# Altium project TMPTBRD_V3.PrjPcb (part 1 of 2)
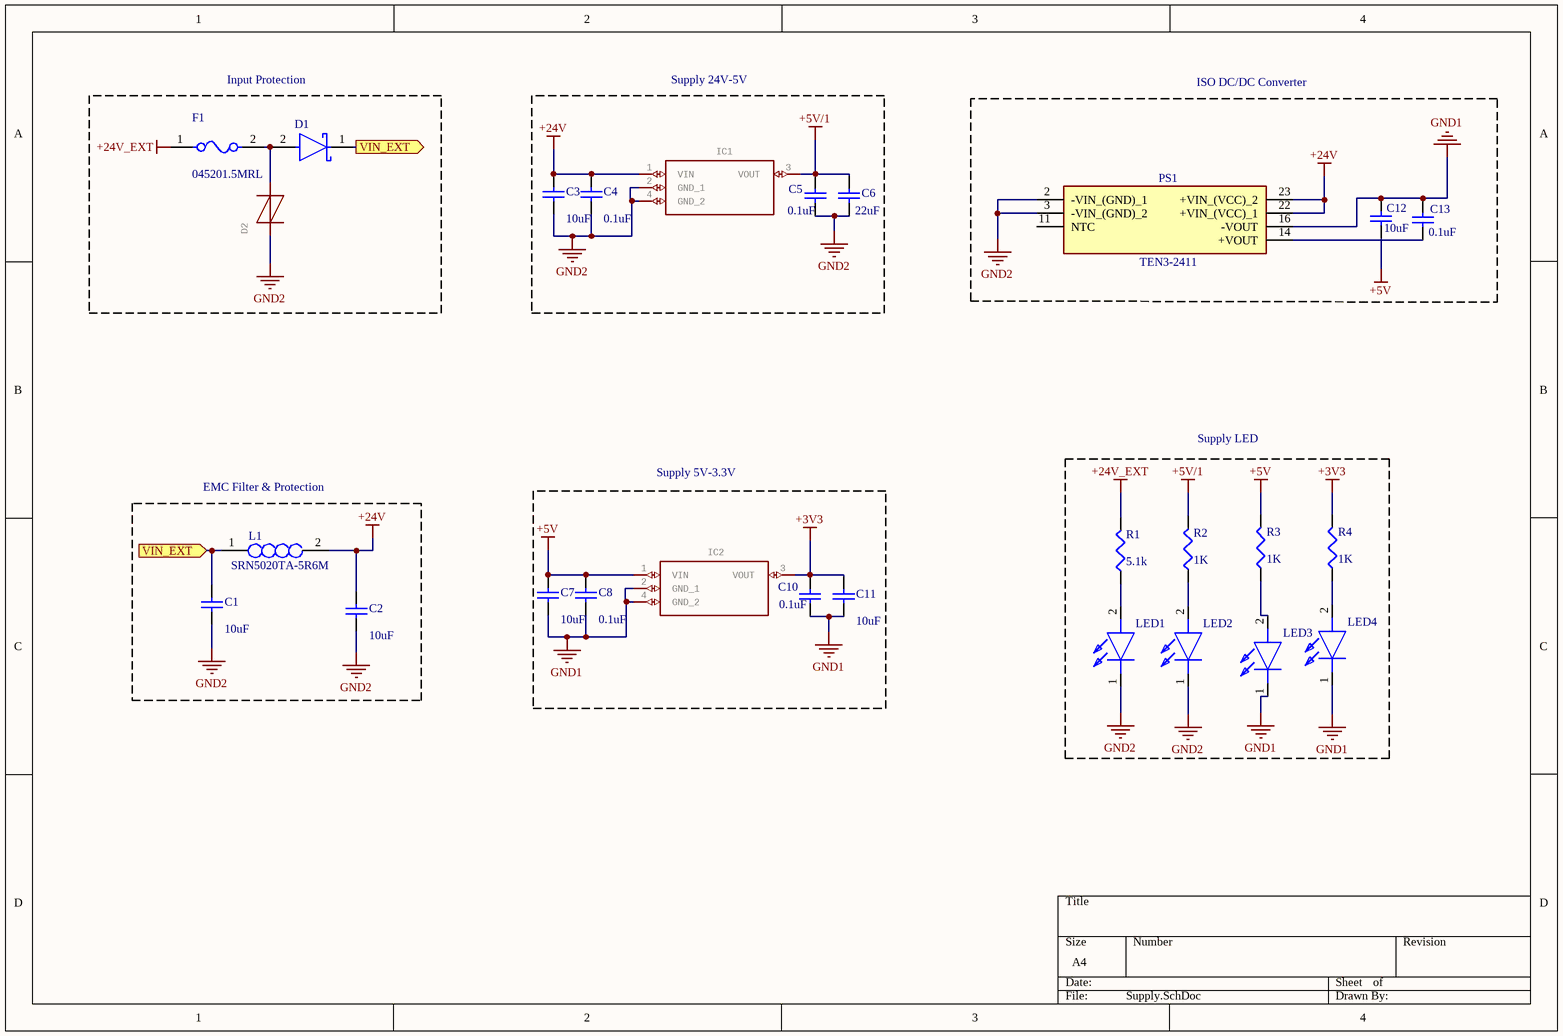
[diagram p0: Supply.SchDoc]
10 sheets, 192 parts. Net scope: flat (ports and power ports of the same name join across sheets).
Sheets:
  Supply.SchDoc
  MCU.SchDoc
  MCU_compnts.SchDoc
  Led RGB.SchDoc
  ISO_CAN2.SchDoc
  EEPROM&RTC.SchDoc
  uSD.SchDoc
  USART.SchDoc
  Relays_channels.SchDoc
  TMPT_LTC_1.SchDoc

## Sheet Supply.SchDoc
size A4; SheetNumber: 1; SheetTotal: 10

### Parts
C1  value 10uF  [1608[0603]]  (hidden comment: Cap Semi)
C2  value 10uF  [1608[0603]]  (hidden comment: Cap Semi)
C3  value 10uF  [1608[0603]]  (hidden comment: Cap Semi)
C4  value 0.1uF  [1608[0603]]  (hidden comment: Cap Semi)
C5  value 0.1uF  [1608[0603]]  (hidden comment: Cap Semi)
C6  value 22uF  [1608[0603]]  (hidden comment: Cap Semi)
C7  value 10uF  [1608[0603]]  (hidden comment: Cap Semi)
C8  value 0.1uF  [1608[0603]]  (hidden comment: Cap Semi)
C10  value 0.1uF  [1608[0603]]  (hidden comment: Cap Semi)
C11  value 10uF  [1608[0603]]  (hidden comment: Cap Semi)
C12  value 10uF  [C1206]  (hidden comment: Cap Semi)
C13  value 0.1uF  [C1206]  (hidden comment: Cap Semi)
D1  NRVTSS5100ET3G  [FP-403A-03-MFG]  (value not drawn)
D2  Thyristor Surge Protection Devices (TSPD) 500A 25V  [LIBRARY_DIODES_FUSE_SMB]  (value not drawn)
F1  045201.5MRL  [FP-0452-MFG]
IC1  LDO LDO Voltage Regulators 5.0V/400MA LDO + Tab-Pin SOT-223  [SOT223]  (value not drawn)
IC2  LDO Regulator 3.3V 1% 300mA SOT223 ON Semiconductor MC33275ST-3.3T3G, LDO Voltage Regulator, 300mA, 3.3 V, Maximum of 13 Vin, 3 + Tab-Pin SOT-223   Source:  Datasheet  [SOT223]  (value not drawn)
L1  SRN5020TA-5R6M  [INDPM5050X200N]
LED1  SML-D12D1WT86  [LEDC1608X55N]  (value not drawn)
LED2  SML-D12D1WT86  [LEDC1608X55N]  (value not drawn)
LED3  SML-D12D1WT86  [LEDC1608X55N]  (value not drawn)
LED4  SML-D12D1WT86  [LEDC1608X55N]  (value not drawn)
PS1  TEN3-2411  [TEN30515N]
R1  value 5.1k  [J1-0603]  (hidden comment: Res3)
R2  value 1K  [J1-0603]  (hidden comment: Res3)
R3  value 1K  [J1-0603]  (hidden comment: Res3)
R4  value 1K  [J1-0603]  (hidden comment: Res3)

### Blocks framed on the sheet
Input Protection: D1 D2 F1
Supply 24V-5V: C3-C6 IC1
ISO DC/DC Converter: C12 C13 PS1
Supply LED: LED1-LED4 R1-R4
EMC Filter & Protection: C1 C2 L1
Supply 5V-3.3V: C7 C8 C10 C11 IC2

### Ports
VIN_EXT (in), VIN_EXT (out)

### Nets
+3V3: C10.2 C11.2 IC2.3(VOUT) R4.2
+5V: C7.2 C8.2 C12.1 IC2.1(VIN) R3.2
+5V/1: C5.2 C6.2 IC1.3(VOUT) R2.2
+24V: C2.2 C3.2 C4.2 IC1.1(VIN) L1.2 PS1.22(+VIN_(VCC)_1) PS1.23(+VIN_(VCC)_2)
+24V_EXT: F1.1 R1.2
GND1: C7.1 C8.1 C10.1 C11.1 C12.2 C13.2 IC2.2(GND_1) IC2.4(GND_2) LED3.1(K) LED4.1(K) PS1.16(-VOUT)
GND2: C1.1 C2.1 C3.1 C4.1 C5.1 C6.1 D2.2(T) IC1.2(GND_1) IC1.4(GND_2) LED1.1(K) LED2.1(K) PS1.2(-VIN_(GND)_1) PS1.3(-VIN_(GND)_2)
NetC1_2: C1.2 D1.1(C) L1.1 ; port VIN_EXT
NetC13_1: C13.1 PS1.14(+VOUT)
NetD1_2: D1.2(A) D2.1(R) F1.2
NetLED1_2: LED1.2(A) R1.1
NetLED2_2: LED2.2(A) R2.1
NetLED3_2: LED3.2(A) R3.1
NetLED4_2: LED4.2(A) R4.1

Not connected (* = marked no-connect by the designer): PS1 11(NTC)

### Library data of the parts
C1-C8 C10-C13 = Cap Semi: Capacitor (Semiconductor SIM Model); Published: 8-Jun-2000; LatestRevisionDate: 29-May-2009; LatestRevisionNote: IPC-7351 Footprint Added.; PackageReference: C1206; Publisher: Altium Limited; PackageDescription: Chip Capacitor
D1 = CMP-07162-000014-1: Trench Schottky Rectifier, Very Low Leakage, 100V, 5A,; Manufacturer: ON Semiconductor; Max Junction Temp: +175°C; Standoff Height: 0.05mm; Peak Reverse Current: 2.6uA; Automotive Grade: Grade 0; Max Surge Forward Current: 50A; Capacitance: 54.5pF; Value: 54.5pF; Category: Diode; Forward Current: 5A; ComponentLink2Description: Datasheet; Reverse Voltage: 100V; Manufacturer Part Number: NRVTSS5100ET3G; Automotive: Yes; ComponentLink2URL: https://www.onsemi.com/pub/Collateral/NRVTSS5100E-D.PDF; Device Class L1: Discrete Semiconductors; Height: 2.47mm; Temperature Range Low: -55°C; Footprint Url: https://www.onsemi.com/pub/Collateral/403A-03.PDF; Lead Free: Yes; Temperature Range High: +175°C; RoHS: TRUE; Temperature: -55°C to +175°C; Device Class L3: Schottky Diodes; Package: 403A-03; Octopart: https://octopart.com/nrvtss5100et3g-on+semiconductor-54318003; Max Repetitive Reverse Voltage: 100V; Device Class L2: Diodes; Mouser Description: Trench Schottky Rectifier, Very Low Leakage, 100V, 5A,
D2 = P0300SCLRP: GateName_1: G$1; SymbolName_1: LIBRARY_DIODES_FUSE_TISP4040H1BJR-S; LibraryName: COMPAQ; DeviceSetName: P0300SCLRP; Package: LIBRARY_DIODES_FUSE_SMB
F1 = CMP-08605-000038-1: FUSE BRD MNT 1.5A 125VAC/VDC SMD; Manufacturer: Littelfuse Inc; Value: 0.093Ω; Fuse Interrupt Ac Current: 50A; Max Fuse Dc Voltage: 125V; Fuse Blow Speed: Slow; Fuse I2T: 3.65A2Sec; Fuse Interrupt Dc Current: 300A; Device Class L2: Fuses; Device Class L3: unset; Temperature Range High: +125°C; Manufacturer Part Number: 045201.5MRL; Temperature: -55°C to +125°C; Fuse Current: 1.5A; ComponentLink2Description: Datasheet; Temperature Range Low: -55°C; Resistance: 0.093Ω; Package: 0452; RoHS: TRUE; Max Fuse Ac Voltage: 125V; Category: Fuse; Mouser Description: Surface Mount Fuses 125V 1.5A; Device Class L1: Circuit Protection; Octopart: https://octopart.com/045201.5mrl-littelfuse-566412; ComponentLink2URL: https://www.littelfuse.com/~/media/electronics/datasheets/fuses/littelfuse_fuse_452_454_datasheet.pdf.pdf; Lead Free: Yes; Automotive: No; Height: 2.94mm; Digikey Description: FUSE BRD MNT 1.5A 125VAC/VDC SMD; Voltage Rating: 125V
IC1 = NCV4274CST50T3G: GateName_1: G$1; SymbolName_1: MC33275ST-3.3T3G; LibraryName: COMPAQ; DeviceSetName: NCV4274CST50T3G; Package: SOT223
IC2 = MC33275ST-3.3T3G: GateName_1: G$1; SymbolName_1: MC33275ST-3.3T3G; LibraryName: COMPAQ; DeviceSetName: MC33275ST-3.3T3G; Package: SOT223
L1 = SRN5020TA-5R6M: Inductor; Manufacturer_Name: Bourns; Datasheet Link: https://www.arrow.com/en/products/srn5020ta-5r6m/bourns; Height: 2mm; Manufacturer_Part_Number: SRN5020TA-5R6M; Mouser Part Number: 652-SRN5020TA-5R6M; Mouser Price/Stock: https://www.mouser.com/Search/Refine.aspx?Keyword=652-SRN5020TA-5R6M; Arrow Part Number: SRN5020TA-5R6M; Arrow Price/Stock: https://www.arrow.com/en/products/srn5020ta-5r6m/bourns
LED1-LED4 = SML-D12D1WT86: LED; Manufacturer_Name: ROHM Semiconductor; Datasheet Link: https://www.rohm.com/datasheet/SML-D12D1W/sml-d12x1-e; Height: 0.55mm; Manufacturer_Part_Number: SML-D12D1WT86; Mouser Part Number: 755-SML-D12D1WT86; Mouser Price/Stock: https://www.mouser.co.uk/ProductDetail/ROHM-Semiconductor/SML-D12D1WT86/?qs=M3jcYzEJUdEqFdUV5eljZg%3D%3D
PS1 = TEN3-2411: Power Supply; Manufacturer_Name: Traco Power; Datasheet Link: https://www.tracopower.com/products/ten3.pdf; Height: 10.7mm; Manufacturer_Part_Number: TEN3-2411
R1-R4 = Res3: Resistor; Published: 8-Jun-2000; LatestRevisionDate: 29-May-2009; LatestRevisionNote: IPC-7351 Footprint Added.; PackageReference: J1-0603; Publisher: Altium Limited; PackageDescription: Chip Resistor

## Sheet MCU.SchDoc
size A4; SheetNumber: 2; SheetTotal: 10
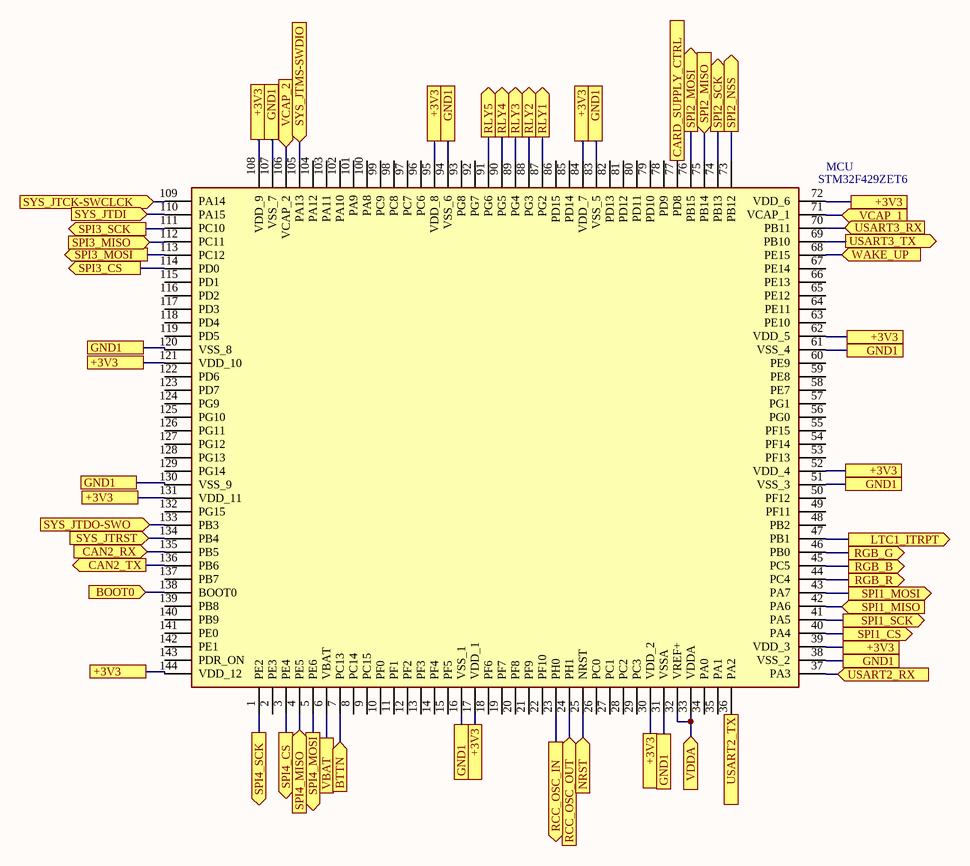
[diagram p1: MCU.SchDoc]

### Parts
MCU  STM32F429ZET6  [QFP50P2200X2200X160-144N]

### Ports
+3V3, BOOT0 (in), BTTN (in), CAN2_RX (in), CAN2_TX (out), CARD_SUPPLY_CTRL (out), GND1, LTC1_ITRPT (out), NRST (in), RCC_OSC_IN (out), RCC_OSC_OUT (in), RGB_B (out), RGB_G (out), RGB_R (out), RLY1 (out), RLY2 (out), RLY3 (out), RLY4 (out), RLY5 (out), SPI1_CS (out), SPI1_MISO (in), SPI1_MOSI (out), SPI1_SCK (out), SPI2_MISO (in), SPI2_MOSI (out), SPI2_NSS (out), SPI2_SCK (out), SPI3_CS (out), SPI3_MISO (in), SPI3_MOSI (out), SPI3_SCK (out), SPI4_CS (out), SPI4_MISO (in), SPI4_MOSI (out), SPI4_SCK (out), SYS_JTCK-SWCLCK (in), SYS_JTDI (in), SYS_JTDO-SWO (in), SYS_JTMS-SWDIO (in), SYS_JTRST (in), USART2_RX (in), USART2_TX (out), USART3_RX (in), USART3_TX (out), VBAT, VCAP_1 (in), VCAP_2 (in), VDDA (in), WAKE_UP (in)

### Nets
+3V3: MCU.17(VDD_1) MCU.30(VDD_2) MCU.39(VDD_3) MCU.52(VDD_4) MCU.62(VDD_5) MCU.72(VDD_6) MCU.84(VDD_7) MCU.95(VDD_8) MCU.108(VDD_9) MCU.121(VDD_10) MCU.131(VDD_11) MCU.144(VDD_12) ; port +3V3
GND1: MCU.7(PC13) MCU.16(VSS_1) MCU.31(VSSA) MCU.38(VSS_2) MCU.51(VSS_3) MCU.61(VSS_4) MCU.83(VSS_5) MCU.94(VSS_6) MCU.107(VSS_7) MCU.120(VSS_8) MCU.130(VSS_9) ; port BTTN, port GND1
NetC14_2: MCU.32(VREF+) MCU.33(VDDA) ; port VDDA
NetC16_2: MCU.71(VCAP_1) ; port VCAP_1
NetC17_2: MCU.106(VCAP_2) ; port VCAP_2
NetC34_1: MCU.25(NRST) ; port NRST
NetC43_2: MCU.6(VBAT) ; port VBAT
NetIC3_3: MCU.136(PB6) ; port CAN2_TX
NetIC3_5: MCU.135(PB5) ; port CAN2_RX
NetIC4_1: MCU.74(PB13) ; port SPI2_SCK
NetIC4_2: MCU.76(PB15) ; port SPI2_MOSI
NetIC4_3: MCU.75(PB14) ; port SPI2_MISO
NetIC4_4: MCU.73(PB12) ; port SPI2_NSS
NetIC6_11: MCU.69(PB10) ; port USART3_TX
NetIC6_12: MCU.70(PB11) ; port USART3_RX
NetIC7_11: MCU.36(PA2) ; port USART2_TX
NetIC7_12: MCU.37(PA3) ; port USART2_RX
NetIC?_3: MCU.41(PA5) ; port SPI1_SCK
NetIC?_4: MCU.43(PA7) ; port SPI1_MOSI
NetIC?_5: MCU.42(PA6) ; port SPI1_MISO
NetIC?_6: MCU.40(PA4) ; port SPI1_CS
NetIC?_9: MCU.47(PB1) ; port LTC1_ITRPT
NetJ2_2: MCU.105(PA13) ; port SYS_JTMS-SWDIO
NetJ2_4: MCU.109(PA14) ; port SYS_JTCK-SWCLCK
NetJ2_6: MCU.133(PB3) ; port SYS_JTDO-SWO
NetJ2_8: MCU.110(PA15) ; port SYS_JTDI
NetJ3_2: MCU.114(PD0) ; port SPI3_CS
NetJ3_3: MCU.113(PC12) ; port SPI3_MOSI
NetJ3_5: MCU.111(PC10) ; port SPI3_SCK
NetJ3_7: MCU.112(PC11) ; port SPI3_MISO
NetJ3_9: MCU.77(PD8) ; port CARD_SUPPLY_CTRL
NetMCU_1: MCU.1(PE2) ; port SPI4_SCK
NetMCU_3: MCU.3(PE4) ; port SPI4_CS
NetMCU_4: MCU.4(PE5) ; port SPI4_MISO
NetMCU_5: MCU.5(PE6) ; port SPI4_MOSI
NetMCU_23: MCU.23(PH0) ; port RCC_OSC_IN
NetMCU_24: MCU.24(PH1) ; port RCC_OSC_OUT
NetMCU_44: MCU.44(PC4) ; port RGB_R
NetMCU_45: MCU.45(PC5) ; port RGB_B
NetMCU_46: MCU.46(PB0) ; port RGB_G
NetMCU_68: MCU.68(PE15) ; port WAKE_UP
NetMCU_87: MCU.87(PG2) ; port RLY1
NetMCU_88: MCU.88(PG3) ; port RLY2
NetMCU_89: MCU.89(PG4) ; port RLY3
NetMCU_90: MCU.90(PG5) ; port RLY4
NetMCU_91: MCU.91(PG6) ; port RLY5
NetMCU_134: MCU.134(PB4) ; port SYS_JTRST
NetMCU_138: MCU.138(BOOT0) ; port BOOT0

Not connected (* = marked no-connect by the designer): MCU 2(PE3) 8(PC14) 9(PC15) 10(PF0) 11(PF1) 12(PF2) 13(PF3) 14(PF4) 15(PF5) 18(PF6) 19(PF7) 20(PF8) 21(PF9) 22(PF10) 26(PC0) 27(PC1) 28(PC2) 29(PC3) 34(PA0) 35(PA1) 48(PB2) 49(PF11) 50(PF12) 53(PF13) 54(PF14) 55(PF15) 56(PG0) 57(PG1) 58(PE7) 59(PE8) 60(PE9) 63(PE10) 64(PE11) 65(PE12) 66(PE13) 67(PE14) 78(PD9) 79(PD10) 80(PD11) 81(PD12) 82(PD13) 85(PD14) 86(PD15) 92(PG7) 93(PG8) 96(PC6) 97(PC7) 98(PC8) 99(PC9) 100(PA8) 101(PA9) 102(PA10) 103(PA11) 104(PA12) 115(PD1) 116(PD2) 117(PD3) 118(PD4) 119(PD5) 122(PD6) 123(PD7) 124(PG9) 125(PG10) 126(PG11) 127(PG12) 128(PG13) 129(PG14) 132(PG15) 137(PB7) 139(PB8) 140(PB9) 141(PE0) 142(PE1) 143(PDR_ON)

### Library data of the parts
MCU = STM32F429ZET6: Integrated Circuit; Manufacturer_Name: STMicroelectronics; Datasheet Link: https://4donline.ihs.com/images/VipMasterIC/IC/SGST/SGST-S-A0001417754/SGST-S-A0001417754-1.pdf?hkey=6D3A4C79FDBF58556ACFDE234799DDF0; Height: 1.6mm; Manufacturer_Part_Number: STM32F429ZET6; Mouser Part Number: 511-STM32F429ZET6; Mouser Price/Stock: https://www.mouser.co.uk/ProductDetail/STMicroelectronics/STM32F429ZET6/?qs=9MuLHSklicp1Z3GRN0zw1w%3D%3D; Arrow Part Number: STM32F429ZET6; Arrow Price/Stock: https://www.arrow.com/en/products/stm32f429zet6/stmicroelectronics

## Sheet MCU_compnts.SchDoc
size A4; SheetNumber: 3; SheetTotal: 6
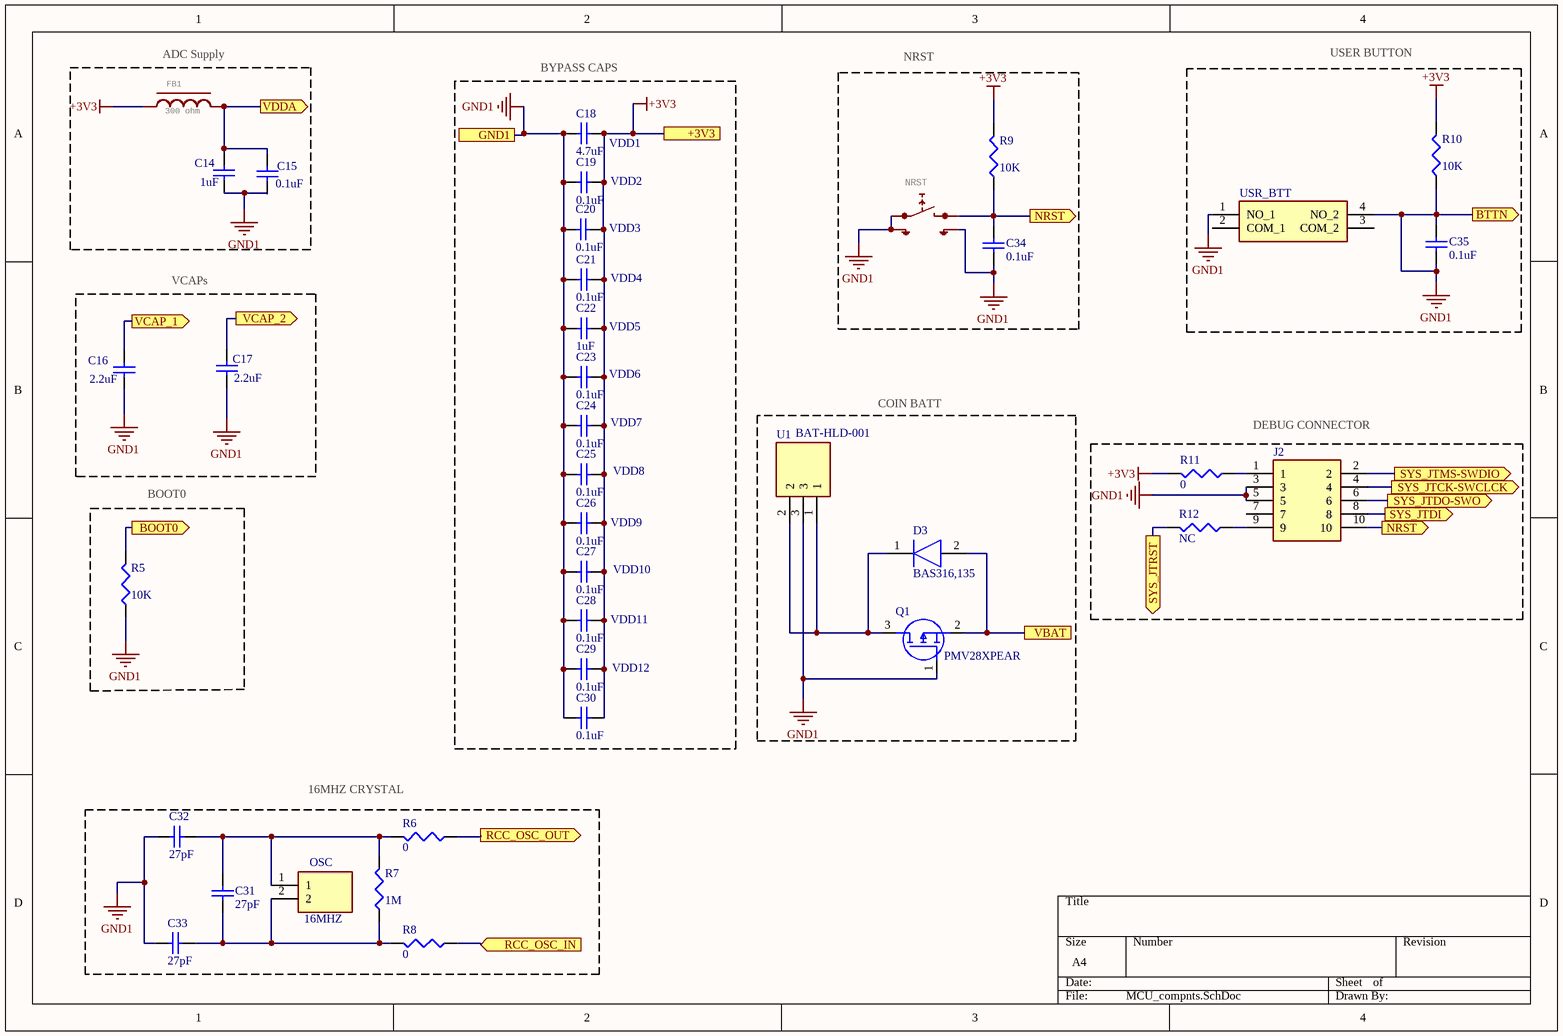
[diagram p2: MCU_compnts.SchDoc]

### Parts
C14  value 1uF  [1608[0603]]  (hidden comment: Cap Semi)
C15  value 0.1uF  [1608[0603]]  (hidden comment: Cap Semi)
C16  value 2.2uF  [1608[0603]]  (hidden comment: Cap Semi)
C17  value 2.2uF  [1608[0603]]  (hidden comment: Cap Semi)
C18  value 4.7uF  [1608[0603]]  (hidden comment: Cap Semi)
C19  value 0.1uF  [1608[0603]]  (hidden comment: Cap Semi)
C20  value 0.1uF  [1608[0603]]  (hidden comment: Cap Semi)
C21  value 0.1uF  [1608[0603]]  (hidden comment: Cap Semi)
C22  value 1uF  [1608[0603]]  (hidden comment: Cap Semi)
C23  value 0.1uF  [1608[0603]]  (hidden comment: Cap Semi)
C24  value 0.1uF  [1608[0603]]  (hidden comment: Cap Semi)
C25  value 0.1uF  [1608[0603]]  (hidden comment: Cap Semi)
C26  value 0.1uF  [1608[0603]]  (hidden comment: Cap Semi)
C27  value 0.1uF  [1608[0603]]  (hidden comment: Cap Semi)
C28  value 0.1uF  [1608[0603]]  (hidden comment: Cap Semi)
C29  value 0.1uF  [1608[0603]]  (hidden comment: Cap Semi)
C30  value 0.1uF  [1608[0603]]  (hidden comment: Cap Semi)
C31  value 27pF  [1608[0603]]  (hidden comment: Cap Semi)
C32  value 27pF  [1608[0603]]  (hidden comment: Cap Semi)
C33  value 27pF  [1608[0603]]  (hidden comment: Cap Semi)
C34  value 0.1uF  [1608[0603]]  (hidden comment: Cap Semi)
C35  value 0.1uF  [1608[0603]]  (hidden comment: Cap Semi)
D3  BAS316,135  [SOD2512X110N]
FB1  300 ohm  [0603_INCH]
J2  FTSH-105-01-L-DV-K-P-TR  [FTSH-105-XX-YYY-DV-K-P-TR]  (value not drawn)
NRST  Tactile Switches 6.1x3.7x2.5mm 100gf  [BOTON_LED_SKQYACE010]  (value not drawn)
OSC  16MHZ  [ABM3AIG16000MHZ81RT]
Q1  PMV28XPEAR  [SOT95P230X110-3N]
R5  value 10K  [J1-0603]  (hidden comment: Res3)
R6  value 0  [J1-0603]  (hidden comment: Res3)
R7  value 1M  [J1-0603]  (hidden comment: Res3)
R8  value 0  [J1-0603]  (hidden comment: Res3)
R9  value 10K  [J1-0603]  (hidden comment: Res3)
R10  value 10K  [J1-0603]  (hidden comment: Res3)
R11  value 0  [J1-0603]  (hidden comment: Res3)
R12  value NC  [J1-0603]  (hidden comment: Res3)
U1  BAT-HLD-001  [BATHLD001]
USR_BTT  KSC621GLFS  [KSC621GLFS]  (value not drawn)

### Blocks framed on the sheet
ADC Supply: C14 C15 FB1
NRST: C34 NRST R9
USER BUTTON: C35 R10 USR_BTT
VCAPs: C16 C17
COIN BATT: D3 Q1 U1
DEBUG CONNECTOR: J2 R11 R12
BOOT0: R5
16MHZ CRYSTAL: C31-C33 OSC R6-R8

### Ports
+3V3, BOOT0 (out), BTTN (out), GND1, NRST (out), RCC_OSC_IN (in), RCC_OSC_OUT (out), SYS_JTCK-SWCLCK (out), SYS_JTDI (out), SYS_JTDO-SWO (out), SYS_JTMS-SWDIO (out), SYS_JTRST (out), VBAT, VCAP_1 (out), VCAP_2 (out), VDDA (out)

### Nets
+3V3: C18.1 C19.1 C20.1 C21.1 C22.1 C23.1 C24.1 C25.1 C26.1 C27.1 C28.1 C29.1 C30.1 FB1.1 R9.2 R10.2 R11.2 ; port +3V3
GND1: C14.1 C15.1 C16.1 C17.1 C18.2 C19.2 C20.2 C21.2 C22.2 C23.2 C24.2 C25.2 C26.2 C27.2 C28.2 C29.2 C30.2 C32.1 C33.2 C34.2 C35.1 C35.2 J2.3 J2.5 NRST.1(1.1) NRST.GND1(SH) NRST.GND2(SH1) Q1.1(G) R5.1 R10.1 U1.3 USR_BTT.1(NO_1) USR_BTT.4(NO_2) ; port BTTN, port GND1
NetC14_2: C14.2 C15.2 FB1.2 ; port VDDA
NetC16_2: C16.2 ; port VCAP_1
NetC17_2: C17.2 ; port VCAP_2
NetC31_1: C31.1 C32.2 OSC.1 R6.2 R7.2
NetC31_2: C31.2 C33.1 OSC.2 R7.1 R8.2
NetC34_1: C34.1 J2.10 NRST.2(2.1) R9.1 ; port NRST
NetC43_2: D3.2(A) Q1.2(S) ; port VBAT
NetD3_1: D3.1(K) Q1.3(D) U1.1 U1.2
NetJ2_1: J2.1 R11.1
NetJ2_2: J2.2 ; port SYS_JTMS-SWDIO
NetJ2_4: J2.4 ; port SYS_JTCK-SWCLCK
NetJ2_6: J2.6 ; port SYS_JTDO-SWO
NetJ2_8: J2.8 ; port SYS_JTDI
NetJ2_9: J2.9 R12.1
NetMCU_23: R8.1 ; port RCC_OSC_IN
NetMCU_24: R6.1 ; port RCC_OSC_OUT
NetMCU_134: R12.2 ; port SYS_JTRST
NetMCU_138: R5.2 ; port BOOT0

Not connected (* = marked no-connect by the designer): J2 7; USR_BTT 2(COM_1) 3(COM_2)

### Notes on the sheet
- BYPASS CAPS
- (near C18) VDD1
- (near C20) VDD3
- (near C19) VDD2
- (near C21) VDD4
- (near C22) VDD5
- (near C23) VDD6
- (near C24) VDD7
- (near C25) VDD8
- (near C26) VDD9
- (near C27) VDD10
- (near C28) VDD11
- (near C29) VDD12

### Library data of the parts
C14-C35 = Cap Semi: Capacitor (Semiconductor SIM Model); Published: 8-Jun-2000; LatestRevisionDate: 29-May-2009; LatestRevisionNote: IPC-7351 Footprint Added.; PackageReference: C1206; Publisher: Altium Limited; PackageDescription: Chip Capacitor
D3 = BAS316,135: Diode; Manufacturer_Name: Nexperia; Datasheet Link: https://assets.nexperia.com/documents/data-sheet/BAS16_SER.pdf; Height: 1.1mm; Manufacturer_Part_Number: BAS316,135; Mouser Part Number: 771-BAS316135; Mouser Price/Stock: https://www.mouser.co.uk/ProductDetail/Nexperia/BAS316135/?qs=me8TqzrmIYU2c3xvA661vA%3D%3D; Arrow Part Number: BAS316,135; Arrow Price/Stock: https://www.arrow.com/en/products/bas316135/nexperia
FB1 = FERRITE-BEAD0603: GateName_1: G$1; SymbolName_1: FBEAD; DeviceName: 0603; LibraryName: COMPAQ; DeviceSetName: FERRITE-BEAD; Package: 0603_INCH
J2 = FTSH-105-01-L-DV-K-P-TR: Connector; Manufacturer_Name: SAMTEC; Datasheet Link: http://suddendocs.samtec.com/prints/ftsh-1xx-xx-xxx-dv-xxx-xxx-mkt.pdf; Manufacturer_Part_Number: FTSH-105-01-L-DV-K-P-TR; Mouser Part Number: 200-FTSH10501LDVKPTR; Mouser Price/Stock: https://www.mouser.co.uk/ProductDetail/Samtec/FTSH-105-01-L-DV-K-P-TR/?qs=fnpEE5GccuMUjCRgxv4voQ%3D%3D; Arrow Part Number: FTSH-105-01-L-DV-K-P-TR; Arrow Price/Stock: https://www.arrow.com/en/products/ftsh-105-01-l-dv-k-p-tr/samtec
NRST = SKQYACE010: GateName_1: G$1; SymbolName_1: BOTON_LED_SIDE_PUSHBUTTON_SHIELD; LibraryName: COMPAQ; DeviceSetName: SKQYACE010; Package: BOTON_LED_SKQYACE010
OSC = ABM3AIG-16.000MHZ-8-1R-T: Crystal or Oscillator; Manufacturer_Name: ABRACON; Datasheet Link: https://abracon.com/AIGcrystals/ABM3AIG.pdf; Height: 1.55mm; Manufacturer_Part_Number: ABM3AIG-16.000MHZ-8-1R-T; Mouser Part Number: 815-M3AIG-16-8-1RT; Mouser Price/Stock: https://www.mouser.co.uk/ProductDetail/ABRACON/ABM3AIG-16000MHZ-8-1R-T/?qs=uwxL4vQweFPcdAO4pz5jNQ%3D%3D
Q1 = PMV28XPEAR: MOSFET (P-Channel); Manufacturer_Name: Nexperia; Datasheet Link: https://componentsearchengine.com/Datasheets/2/PMV28XPEAR.pdf; Height: 1.1mm; Manufacturer_Part_Number: PMV28XPEAR; Mouser Part Number: 771-PMV28XPEAR; Mouser Price/Stock: https://www.mouser.co.uk/ProductDetail/Nexperia/PMV28XPEAR/?qs=W%2FMpXkg%252BdQ6VcRCVGMTksA%3D%3D
R5-R12 = Res3: Resistor; Published: 8-Jun-2000; LatestRevisionDate: 29-May-2009; LatestRevisionNote: IPC-7351 Footprint Added.; PackageReference: J1-0603; Publisher: Altium Limited; PackageDescription: Chip Resistor
U1 = BAT-HLD-001: Undefined or Miscellaneous; Manufacturer_Name: Linx Technologies; Datasheet Link: https://www.mouser.com/ds/2/238/bat-hld-001-220194.pdf; Height: 4mm; Manufacturer_Part_Number: BAT-HLD-001; Mouser Part Number: 712-BAT-HLD-001; Mouser Price/Stock: https://www.mouser.co.uk/ProductDetail/Linx-Technologies/BAT-HLD-001?qs=K5ta8V%252BWhta7hbVGfm4dqA%3D%3D
USR_BTT = KSC621GLFS: Switch; Manufacturer_Name: C & K COMPONENTS; Datasheet Link: https://www.ckswitches.com/media/1972/ksc6.pdf; Height: 7.7mm; Manufacturer_Part_Number: KSC621GLFS; Mouser Part Number: 611-KSC621GLFS; Mouser Price/Stock: https://www.mouser.co.uk/ProductDetail/CK/KSC621GLFS?qs=8LLMQjkBYsIEgc%252BSGMg1mA%3D%3D; Arrow Part Number: KSC621GLFS; Arrow Price/Stock: https://www.arrow.com/en/products/ksc621glfs/ck

## Sheet Led RGB.SchDoc
size A4; SheetNumber: 4; SheetTotal: 5
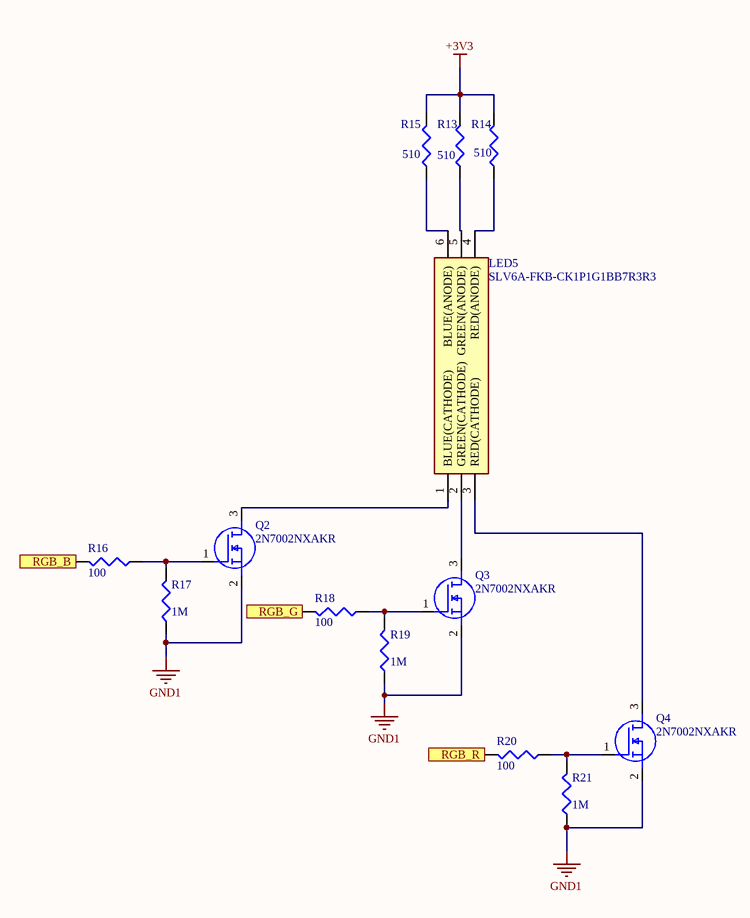
[diagram p3: Led RGB.SchDoc]

### Parts
LED5  SLV6A-FKB-CK1P1G1BB7R3R3  [SLV6AFKBCKNPRGJBB7A363]
Q2  2N7002NXAKR  [SOT95P230X110-3N]
Q3  2N7002NXAKR  [SOT95P230X110-3N]
Q4  2N7002NXAKR  [SOT95P230X110-3N]
R13  value 510  [J1-0603]  (hidden comment: Res3)
R14  value 510  [J1-0603]  (hidden comment: Res3)
R15  value 510  [J1-0603]  (hidden comment: Res3)
R16  value 100  [J1-0603]  (hidden comment: Res3)
R17  value 1M  [J1-0603]  (hidden comment: Res3)
R18  value 100  [J1-0603]  (hidden comment: Res3)
R19  value 1M  [J1-0603]  (hidden comment: Res3)
R20  value 100  [J1-0603]  (hidden comment: Res3)
R21  value 1M  [J1-0603]  (hidden comment: Res3)

### Ports
RGB_B (in), RGB_G (in), RGB_R (in)

### Nets
+3V3: R13.2 R14.2 R15.2
GND1: Q2.2(S) Q3.2(S) Q4.2(S) R17.1 R19.1 R21.1
NetLED5_1: LED5.1(BLUE(CATHODE)) Q2.3(D)
NetLED5_2: LED5.2(GREEN(CATHODE)) Q3.3(D)
NetLED5_3: LED5.3(RED(CATHODE)) Q4.3(D)
NetLED5_4: LED5.4(RED(ANODE)) R14.1
NetLED5_5: LED5.5(GREEN(ANODE)) R13.1
NetLED5_6: LED5.6(BLUE(ANODE)) R15.1
NetMCU_44: R20.2 ; port RGB_R
NetMCU_45: R16.2 ; port RGB_B
NetMCU_46: R18.2 ; port RGB_G
NetQ2_1: Q2.1(G) R16.1 R17.2
NetQ3_1: Q3.1(G) R18.1 R19.2
NetQ4_1: Q4.1(G) R20.1 R21.2

### Library data of the parts
LED5 = SLV6A-FKB-CK1P1G1BB7R3R3: LED; Manufacturer_Name: Cree; Datasheet Link: http://uk.rs-online.com/web/p/products/1684885; Height: 2mm; Manufacturer_Part_Number: SLV6A-FKB-CK1P1G1BB7R3R3; Mouser Part Number: 941-S6AFKBCK1P1G17R3; Mouser Price/Stock: https://www.mouser.co.uk/ProductDetail/Cree-Inc/SLV6A-FKB-CK1P1G1BB7R3R3?qs=6jQbvwb2v93SrlJnkMtIwQ%3D%3D; Arrow Part Number: SLV6A-FKB-CK1P1G1BB7R3R3; Arrow Price/Stock: https://www.arrow.com/en/products/slv6a-fkb-ck1p1g1bb7r3r3/cree
Q2-Q4 = 2N7002NXAKR: MOSFET (N-Channel); Manufacturer_Name: Nexperia; Datasheet Link: https://mouser.componentsearchengine.com/Datasheets/2/2N7002NXAKR.pdf; Height: 1.1mm; Manufacturer_Part_Number: 2N7002NXAKR; Mouser Part Number: 771-2N7002NXAKR; Mouser Price/Stock: https://www.mouser.co.uk/ProductDetail/Nexperia/2N7002NXAKR/?qs=%252B6g0mu59x7JoAsZYPFXqhw%3D%3D; Arrow Part Number: 2N7002NXAKR; Arrow Price/Stock: https://www.arrow.com/en/products/2n7002nxakr/nexperia
R13-R21 = Res3: Resistor; Published: 8-Jun-2000; LatestRevisionDate: 29-May-2009; LatestRevisionNote: IPC-7351 Footprint Added.; PackageReference: J1-0603; Publisher: Altium Limited; PackageDescription: Chip Resistor

## Sheet ISO_CAN2.SchDoc
size A4; SheetNumber: 5; SheetTotal: 6
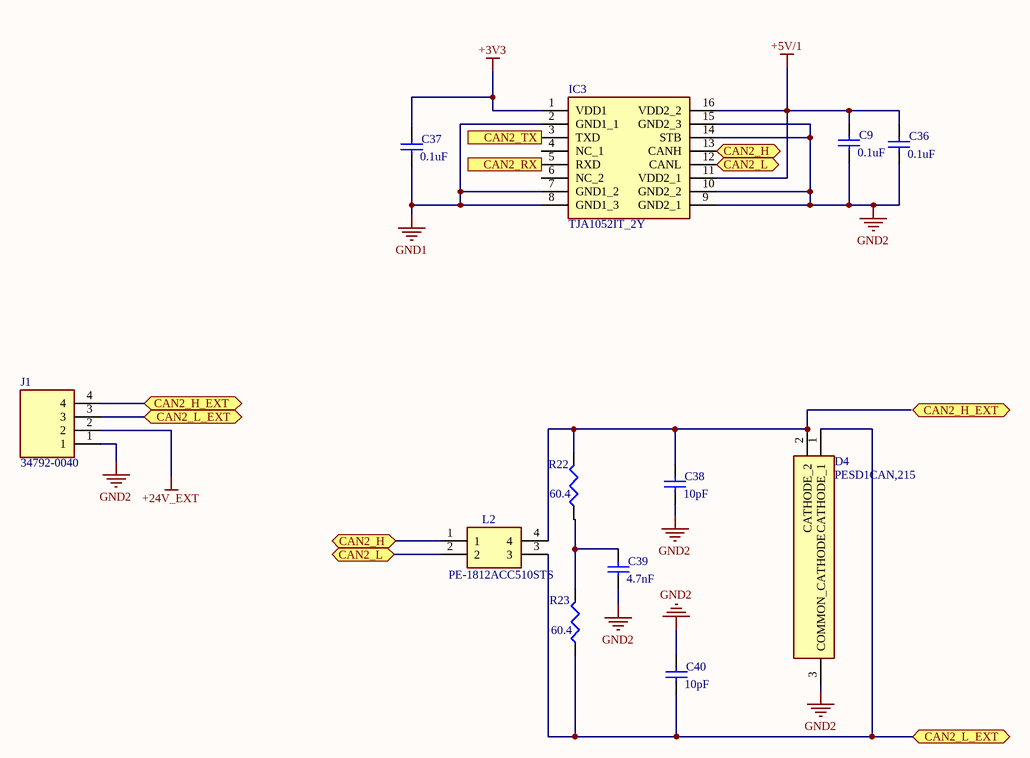
[diagram p4: ISO_CAN2.SchDoc]

### Parts
C9  value 0.1uF  [1608[0603]]  (hidden comment: Cap Semi)
C36  value 0.1uF  [1608[0603]]  (hidden comment: Cap Semi)
C37  value 0.1uF  [1608[0603]]  (hidden comment: Cap Semi)
C38  value 10pF  [1608[0603]]  (hidden comment: Cap Semi)
C39  value 4.7nF  [1608[0603]]  (hidden comment: Cap Semi)
C40  value 10pF  [1608[0603]]  (hidden comment: Cap Semi)
D4  PESD1CAN,215  [SOT95P230X110-3N]
IC3  TJA1052IT_2Y  [SOIC127P1032X265-16N]
J1  34792-0040  [347920040]
L2  PE-1812ACC510STS  [PE1812ACC510STS]
R22  value 60.4  [J1-0603]  (hidden comment: Res3)
R23  value 60.4  [J1-0603]  (hidden comment: Res3)

### Ports
CAN2_H (bidir), CAN2_H_EXT (bidir), CAN2_L (bidir), CAN2_L_EXT (bidir), CAN2_RX (out), CAN2_TX (in)

### Nets
+3V3: C37.2 IC3.1(VDD1)
+5V/1: C9.2 C36.2 IC3.11(VDD2_1) IC3.16(VDD2_2)
+24V_EXT: J1.2
GND1: C37.1 IC3.2(GND1_1) IC3.7(GND1_2) IC3.8(GND1_3)
GND2: C9.1 C36.1 C38.1 C39.1 C40.2 D4.3(COMMON_CATHODE) IC3.9(GND2_1) IC3.10(GND2_2) IC3.14(STB) IC3.15(GND2_3) J1.1
NetC38_2: C38.2 D4.2(CATHODE_2) L2.4 R22.2
NetC39_2: C39.2 R22.1 R23.2
NetC40_1: C40.1 D4.1(CATHODE_1) J1.3 L2.3 R23.1 ; port CAN2_L_EXT
NetIC3_3: IC3.3(TXD) ; port CAN2_TX
NetIC3_5: IC3.5(RXD) ; port CAN2_RX
NetIC3_12: IC3.12(CANL) L2.2 ; port CAN2_L
NetIC3_13: IC3.13(CANH) L2.1 ; port CAN2_H
NetJ1_4: J1.4 ; port CAN2_H_EXT

Not connected (* = marked no-connect by the designer): IC3 4(NC_1) 6(NC_2)

### Library data of the parts
C9 C36-C40 = Cap Semi: Capacitor (Semiconductor SIM Model); Published: 8-Jun-2000; LatestRevisionDate: 29-May-2009; LatestRevisionNote: IPC-7351 Footprint Added.; PackageReference: C1206; Publisher: Altium Limited; PackageDescription: Chip Capacitor
D4 = PESD1CAN,215: Diode ESD (Uni-directional); Manufacturer_Name: Nexperia; Datasheet Link: https://assets.nexperia.com/documents/data-sheet/PESD1CAN.pdf; Height: 1.1mm; Manufacturer_Part_Number: PESD1CAN,215; Mouser Part Number: 771-PESD1CAN-T/R; Mouser Price/Stock: https://www.mouser.co.uk/ProductDetail/Nexperia/PESD1CAN215?qs=LOCUfHb8d9vzREMT8aTFcw%3D%3D; Arrow Part Number: PESD1CAN,215; Arrow Price/Stock: https://www.arrow.com/en/products/pesd1can215/nexperia
IC3 = TJA1052IT_2Y: Integrated Circuit; Manufacturer_Name: NXP; Manufacturer_Part_Number: TJA1052IT/2Y; Datasheet Link: http://www.nxp.com/docs/en/data-sheet/TJA1052I.pdf; Height: 2.65mm; Mouser Part Number: 771-TJA1052IT/2Y; Mouser Price/Stock: https://www.mouser.co.uk/ProductDetail/NXP-Semiconductors/TJA1052IT-2Y?qs=5XOdhvmYM0NQslmwDgd7fw%3D%3D; Arrow Part Number: TJA1052IT/2Y; Arrow Price/Stock: https://www.arrow.com/en/products/tja1052it2y/nxp-semiconductors
J1 = 34792-0040: Connector; Manufacturer_Name: Molex; Datasheet Link: https://componentsearchengine.com/Datasheets/2/34792-0040.pdf; Height: 14.6mm; Manufacturer_Part_Number: 34792-0040; Mouser Part Number: 538-34792-0040; Mouser Price/Stock: https://www.mouser.co.uk/ProductDetail/Molex/34792-0040?qs=rBzrYveeBvGu5%2FZeCi%2F%252BbA%3D%3D
L2 = PE-1812ACC510STS: Inductor; Manufacturer_Name: Pulse; Datasheet Link: https://productfinder.pulseeng.com/doc_type/WEB301/doc_num/W717/doc_part/W717.pdf; Height: 3mm; Manufacturer_Part_Number: PE-1812ACC510STS; Mouser Part Number: 673-PE-1812ACC510STS; Mouser Price/Stock: https://www.mouser.co.uk/ProductDetail/Pulse-Electronics/PE-1812ACC510STS?qs=ar8LaIfZsbGrh9tcPYNGNA%3D%3D; Arrow Part Number: PE-1812ACC510STS; Arrow Price/Stock: https://www.arrow.com/en/products/pe-1812acc510sts/pulse-electronics-corporation
R22 R23 = Res3: Resistor; Published: 8-Jun-2000; LatestRevisionDate: 29-May-2009; LatestRevisionNote: IPC-7351 Footprint Added.; PackageReference: J1-0603; Publisher: Altium Limited; PackageDescription: Chip Resistor

## Sheet EEPROM&RTC.SchDoc
size A4; SheetNumber: 6; SheetTotal: 6
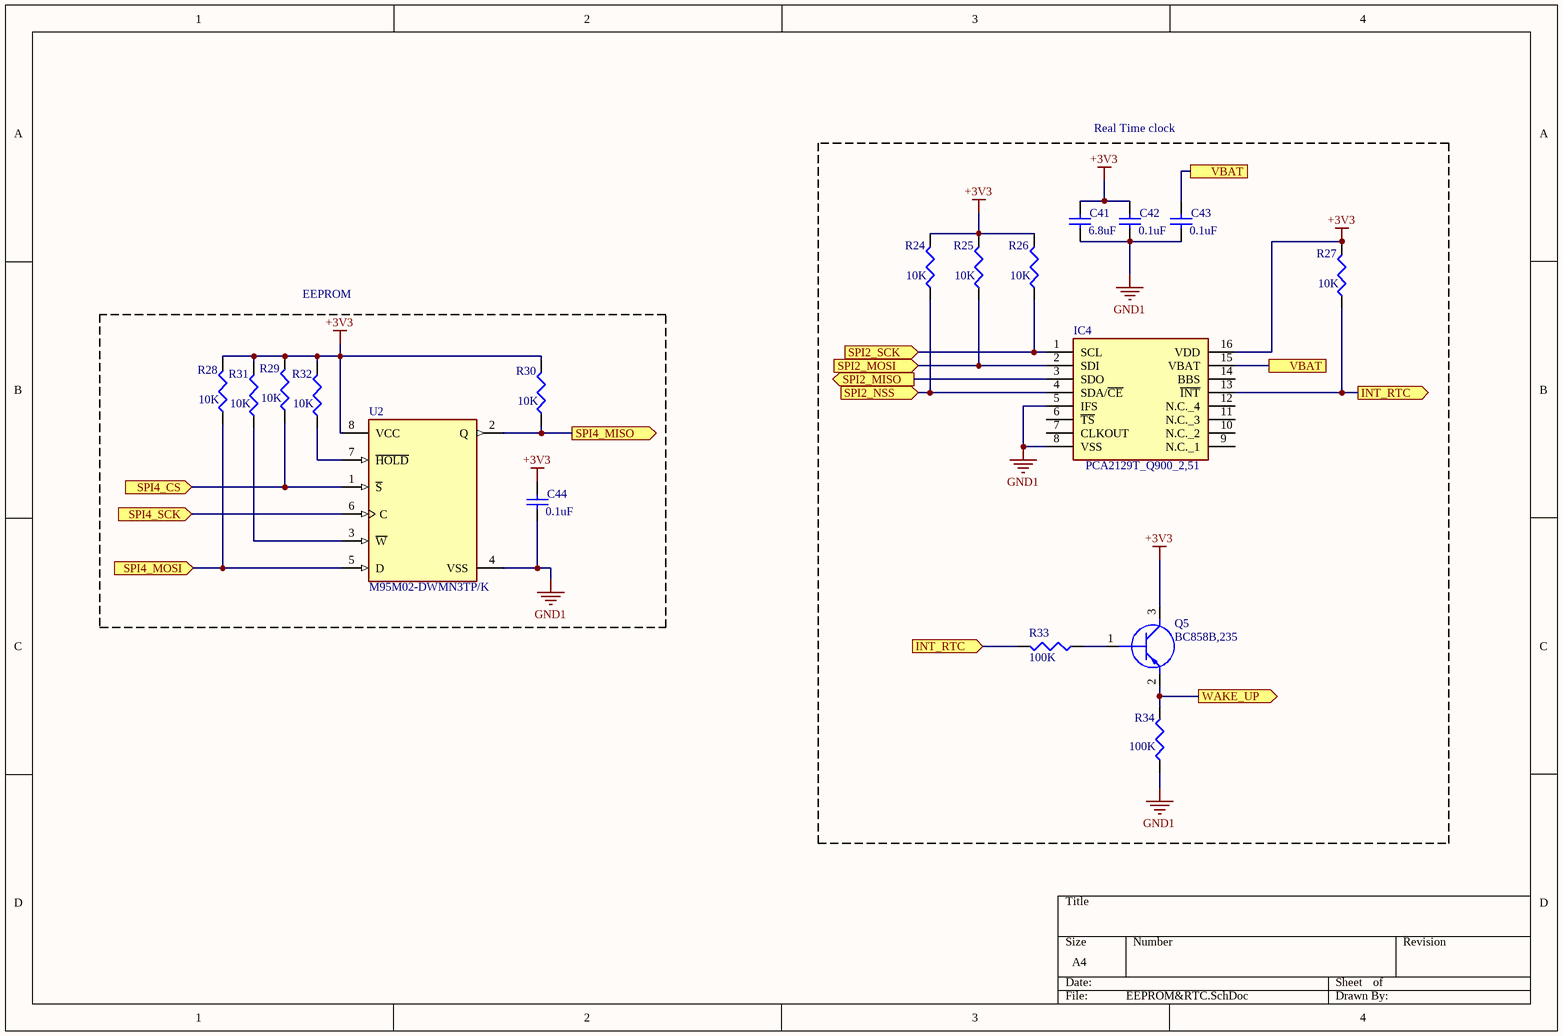
[diagram p5: EEPROM&RTC.SchDoc]

### Parts
C41  value 6.8uF  [1608[0603]]  (hidden comment: Cap Semi)
C42  value 0.1uF  [1608[0603]]  (hidden comment: Cap Semi)
C43  value 0.1uF  [1608[0603]]  (hidden comment: Cap Semi)
C44  value 0.1uF  [1608[0603]]  (hidden comment: Cap Semi)
IC4  PCA2129T_Q900_2,51  [SOIC127P1032X265-16N]
Q5  BC858B,235  [SOT95P230X110-3N]
R24  value 10K  [J1-0603]  (hidden comment: Res3)
R25  value 10K  [J1-0603]  (hidden comment: Res3)
R26  value 10K  [J1-0603]  (hidden comment: Res3)
R27  value 10K  [J1-0603]  (hidden comment: Res3)
R28  value 10K  [J1-0603]  (hidden comment: Res3)
R29  value 10K  [J1-0603]  (hidden comment: Res3)
R30  value 10K  [J1-0603]  (hidden comment: Res3)
R31  value 10K  [J1-0603]  (hidden comment: Res3)
R32  value 10K  [J1-0603]  (hidden comment: Res3)
R33  value 100K  [J1-0603]  (hidden comment: Res3)
R34  value 100K  [J1-0603]  (hidden comment: Res3)
U2  M95M02-DWMN3TP/K  [FP-SO8N-SO-A-MFG]

### Blocks framed on the sheet
Real Time clock: C41-C43 IC4 Q5 R24-R27 R33 R34
EEPROM: C44 R28-R32 U2

### Ports
INT_RTC (in), INT_RTC (out), SPI2_MISO (out), SPI2_MOSI (in), SPI2_NSS (in), SPI2_SCK (in), SPI4_CS (in), SPI4_MISO (out), SPI4_MOSI (in), SPI4_SCK (in), VBAT, WAKE_UP (out)

### Nets
+3V3: C41.2 C42.2 C44.2 IC4.16(VDD) Q5.3(C) R24.2 R25.2 R26.2 R27.2 R28.2 R29.2 R30.2 R31.2 R32.2 U2.8(VCC)
GND1: C41.1 C42.1 C43.1 C44.1 IC4.5(IFS) IC4.8(VSS) R34.1 U2.4(VSS)
NetC43_2: C43.2 IC4.15(VBAT) ; port VBAT
NetIC4_1: IC4.1(SCL) R26.1 ; port SPI2_SCK
NetIC4_2: IC4.2(SDI) R25.1 ; port SPI2_MOSI
NetIC4_3: IC4.3(SDO) ; port SPI2_MISO
NetIC4_4: IC4.4(SDA/~{CE}) R24.1 ; port SPI2_NSS
NetIC4_13: IC4.13(~{INT}) R27.1 R33.2 ; port INT_RTC
NetMCU_1: U2.6(C) ; port SPI4_SCK
NetMCU_3: R29.1 U2.1(~{S}) ; port SPI4_CS
NetMCU_4: R30.1 U2.2(Q) ; port SPI4_MISO
NetMCU_5: R28.1 U2.5(D) ; port SPI4_MOSI
NetMCU_68: Q5.2(E) R34.2 ; port WAKE_UP
NetQ5_1: Q5.1(B) R33.1
NetR31_1: R31.1 U2.3(~{W})
NetR32_1: R32.1 U2.7(~{HOLD})

Not connected (* = marked no-connect by the designer): IC4 6(~{TS}) 7(CLKOUT) 9(N.C._1) 10(N.C._2) 11(N.C._3) 12(N.C._4) 14(BBS)

### Library data of the parts
C41-C44 = Cap Semi: Capacitor (Semiconductor SIM Model); Published: 8-Jun-2000; LatestRevisionDate: 29-May-2009; LatestRevisionNote: IPC-7351 Footprint Added.; PackageReference: C1206; Publisher: Altium Limited; PackageDescription: Chip Capacitor
IC4 = PCA2129T_Q900_2,51: Integrated Circuit; Manufacturer_Name: NXP; Manufacturer_Part_Number: PCA2129T/Q900/2,51; Datasheet Link: http://www.nxp.com/docs/en/data-sheet/PCA2129.pdf; Height: 2.65mm; Mouser Part Number: 771-PCA2129TQ900251; Mouser Price/Stock: https://www.mouser.co.uk/ProductDetail/NXP-Semiconductors/PCA2129T-Q900-251?qs=cbprxTG2Yq%2F%2FjRzXwigwjQ%3D%3D; Arrow Part Number: PCA2129T/Q900/2,51; Arrow Price/Stock: https://www.arrow.com/en/products/pca2129tq900251/nxp-semiconductors
Q5 = BC858B,235: Transistor BJT PNP; Manufacturer_Name: Nexperia; Datasheet Link: http://assets.nexperia.com/documents/data-sheet/BC856_BC857_BC858.pdf; Height: 1.1mm; Manufacturer_Part_Number: BC858B,235; Mouser Part Number: 771-BC858B235; Mouser Price/Stock: https://www.mouser.co.uk/ProductDetail/Nexperia/BC858B235/?qs=me8TqzrmIYXYzaJ2wqapBg%3D%3D; Arrow Part Number: BC858B,235; Arrow Price/Stock: https://www.arrow.com/en/products/bc858b235/nexperia
R24-R34 = Res3: Resistor; Published: 8-Jun-2000; LatestRevisionDate: 29-May-2009; LatestRevisionNote: IPC-7351 Footprint Added.; PackageReference: J1-0603; Publisher: Altium Limited; PackageDescription: Chip Resistor
U2 = CMP-12142-000005-1: IC EEPROM 2M SPI 10MHZ 8SO; Manufacturer: STMicroelectronics; Nominal Supply Current: 2-5mA; Min Supply Voltage: 2.5V; Standoff Height: 0.1mm; Access Time: 80ns; Automotive Grade: Grade 0; Max Supply Voltage: 5.5V; Frequency: 5MHz; Memory Size: 2Mbits; Manufacturer Part Number: M95M02-DWMN3TP/K; RoHS: TRUE; Ipc Land Pattern Name: SOIC127P600X175-8; Temperature Range Low: -40°C; Mouser Description: STMICROELECTRONICS - M95M02-DWMN3TP/K - EEPROM, AEC-Q100, 2MBIT, SPI, SOIC-8; Device Class L2: Memory; Lead Free: Yes; Octopart: https://octopart.com/m95m02-dwmn3tp%2Fk-stmicroelectronics-52112703; Automotive: Yes; Category: IC; Package: SO8N-SO-A; Temperature Range High: +125°C; ComponentLink2URL: https://www.st.com/resource/en/datasheet/m95m02-a125.pdf; Device Class L1: Integrated Circuits (ICs); Temperature: -40°C to +125°C; Memory Type: EEPROM; Device Class L3: EEPROM; Ambient Temperature Range Low: -40°C; ComponentLink2Description: Datasheet; Digikey Description: IC EEPROM 2M SPI 10MHZ 8SO; Height: 1.75mm; Interface: SPI; Ambient Temperature Range High: +125°C

## Sheet uSD.SchDoc
size A4; SheetNumber: 7; SheetTotal: 8
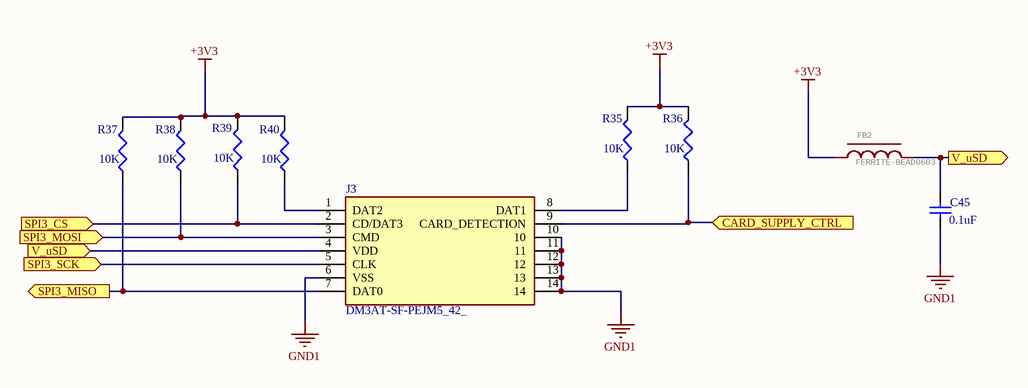
[diagram p6: uSD.SchDoc]

### Parts
C45  value 0.1uF  [1608[0603]]  (hidden comment: Cap Semi)
FB2  FERRITE-BEAD0603  [0603_INCH]
J3  DM3AT-SF-PEJM5_42_  [DM3ATSFPEJM542]
R35  value 10K  [J1-0603]  (hidden comment: Res3)
R36  value 10K  [J1-0603]  (hidden comment: Res3)
R37  value 10K  [J1-0603]  (hidden comment: Res3)
R38  value 10K  [J1-0603]  (hidden comment: Res3)
R39  value 10K  [J1-0603]  (hidden comment: Res3)
R40  value 10K  [J1-0603]  (hidden comment: Res3)

### Ports
CARD_SUPPLY_CTRL (in), SPI3_CS (in), SPI3_MISO (out), SPI3_MOSI (in), SPI3_SCK (in), V_uSD (in), V_uSD (out)

### Nets
+3V3: FB2.1 R35.2 R36.2 R37.2 R38.2 R39.2 R40.2
GND1: C45.1 J3.6(VSS) J3.10 J3.11 J3.12 J3.13 J3.14
NetC45_2: C45.2 FB2.2 J3.4(VDD) ; port V_uSD
NetJ3_1: J3.1(DAT2) R40.1
NetJ3_2: J3.2(CD/DAT3) R39.1 ; port SPI3_CS
NetJ3_3: J3.3(CMD) R38.1 ; port SPI3_MOSI
NetJ3_5: J3.5(CLK) ; port SPI3_SCK
NetJ3_7: J3.7(DAT0) R37.1 ; port SPI3_MISO
NetJ3_8: J3.8(DAT1) R35.1
NetJ3_9: J3.9(CARD_DETECTION) R36.1 ; port CARD_SUPPLY_CTRL

### Library data of the parts
C45 = Cap Semi: Capacitor (Semiconductor SIM Model); Published: 8-Jun-2000; LatestRevisionDate: 29-May-2009; LatestRevisionNote: IPC-7351 Footprint Added.; PackageReference: C1206; Publisher: Altium Limited; PackageDescription: Chip Capacitor
FB2 = FERRITE-BEAD0603: as FB1 on sheet MCU_compnts; LibraryName: COMPAQ; DeviceSetName: FERRITE-BEAD; Package: 0603_INCH
J3 = DM3AT-SF-PEJM5_42_: Connector; Manufacturer_Name: Hirose; Manufacturer_Part_Number: DM3AT-SF-PEJM5(42); Datasheet Link: https://www.hirose.com/product/document?clcode=CL0609-0031-0-00&productname=DM3AT-SF-PEJM5&series=DM3&documenttype=2DDrawing&lang=en&documentid=0000947170; Height: 1.83mm; Mouser Part Number: 798-DM3AT-SF-PEJM542; Mouser Price/Stock: https://www.mouser.co.uk/ProductDetail/Hirose-Connector/DM3AT-SF-PEJM542?qs=%252BAZVS4b%2FkgKS6d9u59mSuA%3D%3D
R35-R40 = Res3: Resistor; Published: 8-Jun-2000; LatestRevisionDate: 29-May-2009; LatestRevisionNote: IPC-7351 Footprint Added.; PackageReference: J1-0603; Publisher: Altium Limited; PackageDescription: Chip Resistor

## Sheet USART.SchDoc
size A4; SheetNumber: 8; SheetTotal: 8
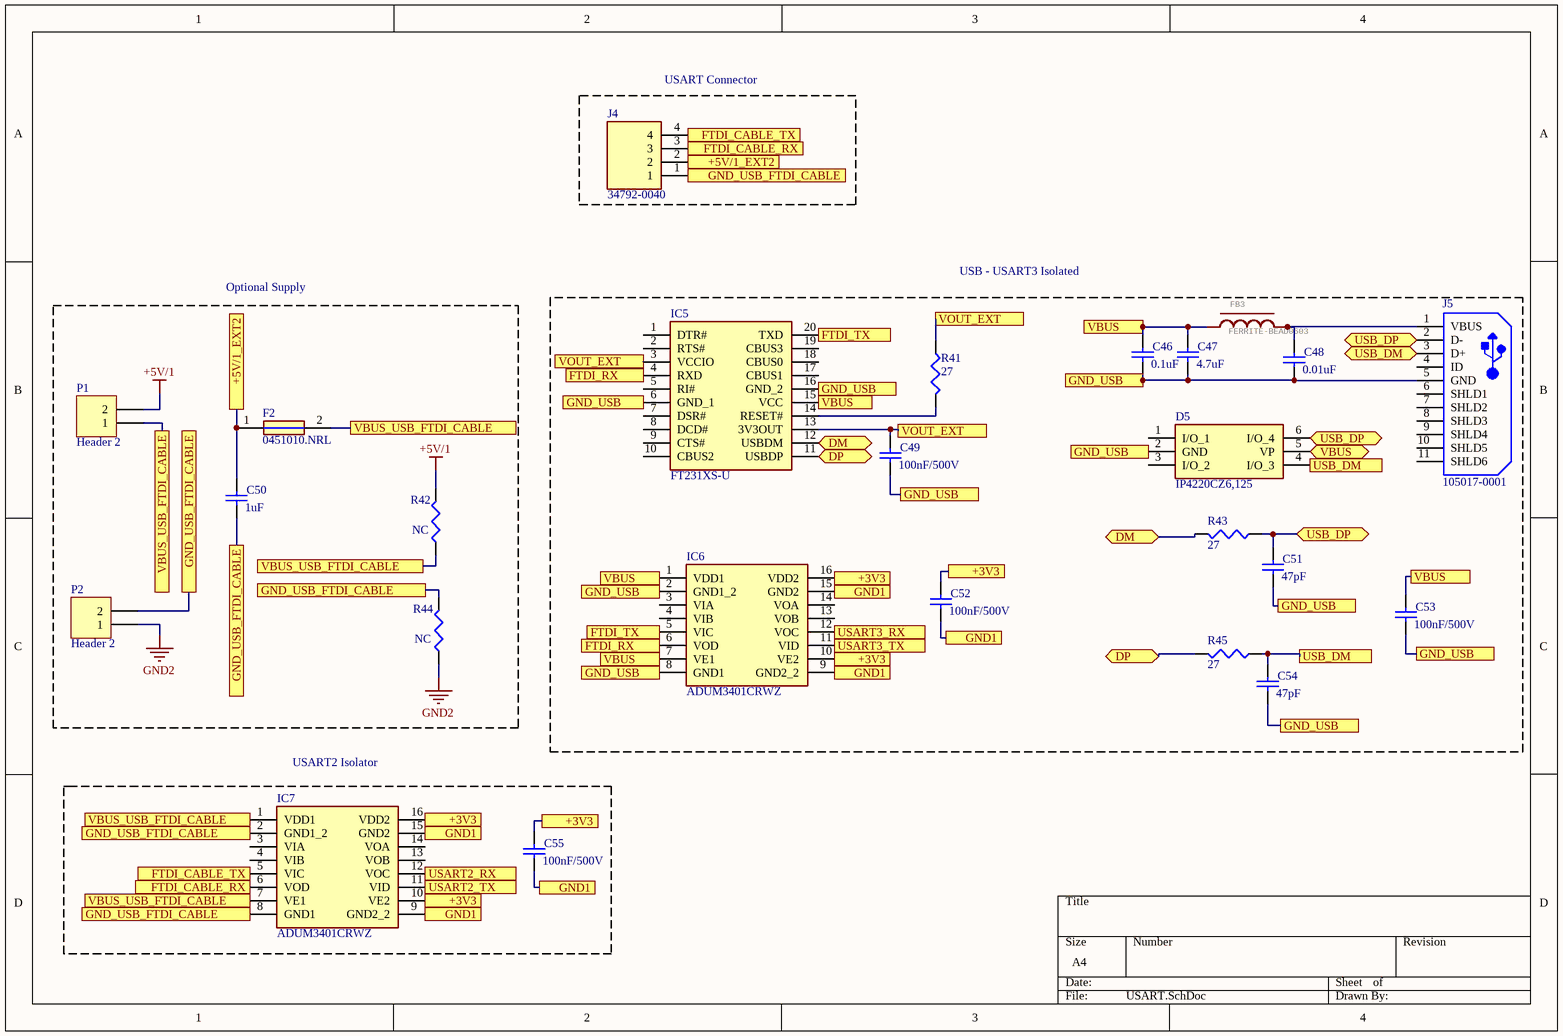
[diagram p7: USART.SchDoc]

### Parts
C46  value 0.1uF  [1608[0603]]  (hidden comment: Cap Semi)
C47  value 4.7uF  [C1206]  (hidden comment: Cap Semi)
C48  value 0.01uF  [1608[0603]]  (hidden comment: Cap Semi)
C49  value 100nF/500V  [1608[0603]]  (hidden comment: Cap Semi)
C50  value 1uF  [1608[0603]]  (hidden comment: Cap Semi)
C51  value 47pF  [1608[0603]]  (hidden comment: Cap Semi)
C52  value 100nF/500V  [1608[0603]]  (hidden comment: Cap Semi)
C53  value 100nF/500V  [1608[0603]]  (hidden comment: Cap Semi)
C54  value 47pF  [1608[0603]]  (hidden comment: Cap Semi)
C55  value 100nF/500V  [1608[0603]]  (hidden comment: Cap Semi)
D5  IP4220CZ6,125  [SOT95P275X110-6N]
F2  0451010.NRL  [FUSC6127X294N]
FB3  FERRITE-BEAD0603  [0603_INCH]
IC5  FT231XS-U  [SOP64P599X175-20N]
IC6  ADUM3401CRWZ  [SOIC127P1032X265-16N]
IC7  ADUM3401CRWZ  [SOIC127P1032X265-16N]
J4  34792-0040  [347920040]
J5  105017-0001  [USB-MICRO-B_V]
P1  Header 2  [HDR1X2]
P2  Header 2  [HDR1X2]
R41  value 27  [J1-0603]  (hidden comment: Res3)
R42  value NC  [J1-0603]  (hidden comment: Res3)
R43  value 27  [J1-0603]  (hidden comment: Res3)
R44  value NC  [J1-0603]  (hidden comment: Res3)
R45  value 27  [J1-0603]  (hidden comment: Res3)

### Blocks framed on the sheet
USART Connector: J4
USB - USART3 Isolated: C46-C49 C51-C54 D5 FB3 IC5 IC6 J5 R41 R43 R45
Optional Supply: C50 F2 P1 P2 R42 R44
USART2 Isolator: C55 IC7

### Ports
+3V3, +5V/1_EXT2, DM (bidir), DP (bidir), FTDI_CABLE_RX (in), FTDI_CABLE_RX (out), FTDI_CABLE_TX (in), FTDI_CABLE_TX (out), FTDI_RX (in), FTDI_RX (out), FTDI_TX (in), FTDI_TX (out), GND1, GND_USB, GND_USB_FTDI_CABLE, USART2_RX (out), USART2_TX (in), USART3_RX (out), USART3_TX (in), USB_DM, USB_DM (bidir), USB_DP (bidir), VBUS, VBUS (bidir), VBUS_USB_FTDI_CABLE, VOUT_EXT

### Nets
+3V3: C52.2 C55.2 IC6.10(VE2) IC6.16(VDD2) IC7.10(VE2) IC7.16(VDD2) ; port +3V3
+5V/1: P1.2 R42.2
GND1: C52.1 C55.1 IC6.9(GND2_2) IC6.15(GND2) IC7.9(GND2_2) IC7.15(GND2) ; port GND1
GND2: P2.1 R44.1
NetC46_1: C46.1 C47.1 C48.1 C49.1 C51.1 C53.1 C54.1 D5.2(GND) IC5.6(GND_1) IC5.16(GND_2) IC6.2(GND1_2) IC6.8(GND1) J5.5(GND) ; port GND_USB
NetC46_2: C46.2 C47.2 C53.2 D5.5(VP) FB3.1 IC5.15(VCC) IC6.1(VDD1) IC6.7(VE1) ; port VBUS
NetC48_2: C48.2 FB3.2 J5.1(VBUS)
NetC49_2: C49.2 IC5.3(VCCIO) IC5.13(3V3OUT) R41.1 ; port VOUT_EXT
NetC50_1: C50.1 IC7.2(GND1_2) IC7.8(GND1) J4.1 P2.2 R44.2 ; port GND_USB_FTDI_CABLE
NetC50_2: C50.2 F2.1 J4.2 ; port +5V/1_EXT2
NetC51_2: C51.2 D5.6(I/O_4) J5.2(D-) R43.1 ; port USB_DP
NetC54_2: C54.2 D5.4(I/O_3) J5.3(D+) R45.1 ; port USB_DM
NetF2_2: F2.2 IC7.1(VDD1) IC7.7(VE1) P1.1 R42.1 ; port VBUS_USB_FTDI_CABLE
NetIC5_4: IC5.4(RXD) IC6.6(VOD) ; port FTDI_RX
NetIC5_11: IC5.11(USBDP) R45.2 ; port DP
NetIC5_12: IC5.12(USBDM) R43.2 ; port DM
NetIC5_14: IC5.14(RESET#) R41.2
NetIC5_20: IC5.20(TXD) IC6.5(VIC) ; port FTDI_TX
NetIC6_11: IC6.11(VID) ; port USART3_TX
NetIC6_12: IC6.12(VOC) ; port USART3_RX
NetIC7_5: IC7.5(VIC) J4.4 ; port FTDI_CABLE_TX
NetIC7_6: IC7.6(VOD) J4.3 ; port FTDI_CABLE_RX
NetIC7_11: IC7.11(VID) ; port USART2_TX
NetIC7_12: IC7.12(VOC) ; port USART2_RX

Not connected (* = marked no-connect by the designer): D5 1(I/O_1) 3(I/O_2); IC5 1(DTR#) 2(RTS#) 5(RI#) 7(DSR#) 8(DCD#) 9(CTS#) 10(CBUS2) 17(CBUS1) 18(CBUS0) 19(CBUS3); IC6 3(VIA) 4(VIB) 13(VOB) 14(VOA); IC7 3(VIA) 4(VIB) 13(VOB) 14(VOA); J5 4(ID) 6(SHLD1) 7(SHLD2) 8(SHLD3) 9(SHLD4) 10(SHLD5) 11(SHLD6)

### Library data of the parts
C46-C55 = Cap Semi: Capacitor (Semiconductor SIM Model); Published: 8-Jun-2000; LatestRevisionDate: 29-May-2009; LatestRevisionNote: IPC-7351 Footprint Added.; PackageReference: C1206; Publisher: Altium Limited; PackageDescription: Chip Capacitor
D5 = IP4220CZ6,125: Diode; Manufacturer_Name: Nexperia; Datasheet Link: https://assets.nexperia.com/documents/data-sheet/IP4220CZ6.pdf; Height: 1.1mm; Manufacturer_Part_Number: IP4220CZ6,125; Mouser Part Number: 771-IP4220CZ6-T/R; Mouser Price/Stock: https://www.mouser.co.uk/ProductDetail/Nexperia/IP4220CZ6125?qs=me8TqzrmIYWNWIOv4%2FpxMw%3D%3D; Arrow Part Number: IP4220CZ6,125; Arrow Price/Stock: https://www.arrow.com/en/products/ip4220cz6125/nexperia
F2 = 0451010.NRL: Fuse; Manufacturer_Name: LITTELFUSE; Datasheet Link: http://www.littelfuse.com/~/media/electronics/datasheets/fuses/littelfuse_fuse_451_453_datasheet.pdf.pdf; Height: 2.94mm; Manufacturer_Part_Number: 0451010.NRL; Mouser Part Number: 576-0451010.NRL; Mouser Price/Stock: https://www.mouser.co.uk/ProductDetail/Littelfuse/0451010NRL/?qs=PalBzRKzfnsOVNx2qOnhDw%3D%3D; Arrow Part Number: 0451010.NRL; Arrow Price/Stock: https://www.arrow.com/en/products/0451010.nrl/littelfuse
FB3 = FERRITE-BEAD0603: as FB1 on sheet MCU_compnts; LibraryName: COMPAQ; DeviceSetName: FERRITE-BEAD; Package: 0603_INCH
IC5 = FT231XS-U: Integrated Circuit; Manufacturer_Name: FTDI Chip; Datasheet Link: https://www.ftdichip.com/Support/Documents/DataSheets/ICs/DS_FT231X.pdf; Height: 1.753mm; Manufacturer_Part_Number: FT231XS-U; Mouser Part Number: 895-FT231XS-U; Mouser Price/Stock: https://www.mouser.co.uk/ProductDetail/FTDI/FT231XS-U/?qs=Gp1Yz1mis3WFP7tMtj2Z9g%3D%3D; Arrow Part Number: FT231XS-U; Arrow Price/Stock: https://www.arrow.com/en/products/ft231xs-u/ftdi-chip
IC6 IC7 = ADUM3401CRWZ: Integrated Circuit; Manufacturer_Name: Analog Devices; Manufacturer_Part_Number: ADUM3401CRWZ; Mouser Part Number: 584-ADUM3401CRWZ; Mouser Price/Stock: https://www.mouser.co.uk/ProductDetail/Analog-Devices/ADUM3401CRWZ?qs=WIvQP4zGangWcd%252B5oSrqEw%3D%3D; Arrow Part Number: ADUM3401CRWZ; Arrow Price/Stock: https://www.arrow.com/en/products/adum3401crwz/analog-devices
J4 = 34792-0040: Connector; Manufacturer_Name: Molex; Datasheet Link: https://componentsearchengine.com/Datasheets/2/34792-0040.pdf; Height: 14.6mm; Manufacturer_Part_Number: 34792-0040; Mouser Part Number: 538-34792-0040; Mouser Price/Stock: https://www.mouser.co.uk/ProductDetail/Molex/34792-0040?qs=rBzrYveeBvGu5%2FZeCi%2F%252BbA%3D%3D
J5 = CMP-2000-05827-1: Micro-USB B Receptacle, Right Angle, Bottom Mount, Surface Mount, with Solder Tabs, -30 to 85 degC, 5-Pin USB, RoHS, Tape and Reel; Manufacturer: Molex; Featured Product: Micro-USBConnectorsUSBConnectors; Other Names: WM1399DKR; Package Version: Rev. F, 12/2012; Number of Contacts: 5; Connector Type: USB-microB; Catalog Drawings: 1050170001; 3D Model: 105017-0001.stp; Mating Products: WM17145-ND-CABLEMICROUSBBTOSTDA1.0MWM17147-ND-CABLEMICROUSBBTOSTDA2.0MWM17146-ND-CABLEMICROUSBBTOSTDA1.5M; PCN Assembly/Origin: ResinSupplier21/Oct/2015; Voltage - Max: 30V; Online Catalog: Molex-MicroUSB; Manufacturer URL: http://www.molex.com/; Package Description: 5-Leads USB, Micro B, Body 7.5 x 5 mm, Pitch 0.65 mm; Datasheet URL: http://www.molex.com/elqNow/elqRedir.htm?ref=http://www.molex.com/webdocs/datasheets/pdf/en-us/1050170001_IO_CONNECTORS.pdf; Ingress Protection: -; Datasheet Version: 03/2016; Mounting Type: BoardCutout,SurfaceMount,RightAngle; Circuits: 5; Standard Package: 1; Package Reference: MICRO-B; Package URL: http://www.molex.com/pdm_docs/sd/1050170001_sd.pdf; Category: Connectors,Interconnects; Series: -; RoHS Information: 1050170001CertofCompliance; Features: Shielded,SolderRetention; Family: USB,DVI,HDMIConnectors; Specifications: -; Gender: Receptacle; Packaging: Digi-Reel®; Mounting Technology: SurfaceMount
P1 P2 = Header 2: Header, 2-Pin; LatestRevisionDate: 17-Jul-2002; LatestRevisionNote: Re-released for DXP Platform.; Publisher: Altium Limited
R41-R45 = Res3: Resistor; Published: 8-Jun-2000; LatestRevisionDate: 29-May-2009; LatestRevisionNote: IPC-7351 Footprint Added.; PackageReference: J1-0603; Publisher: Altium Limited; PackageDescription: Chip Resistor

## Sheet Relays_channels.SchDoc
size A4; SheetNumber: 9; SheetTotal: 10
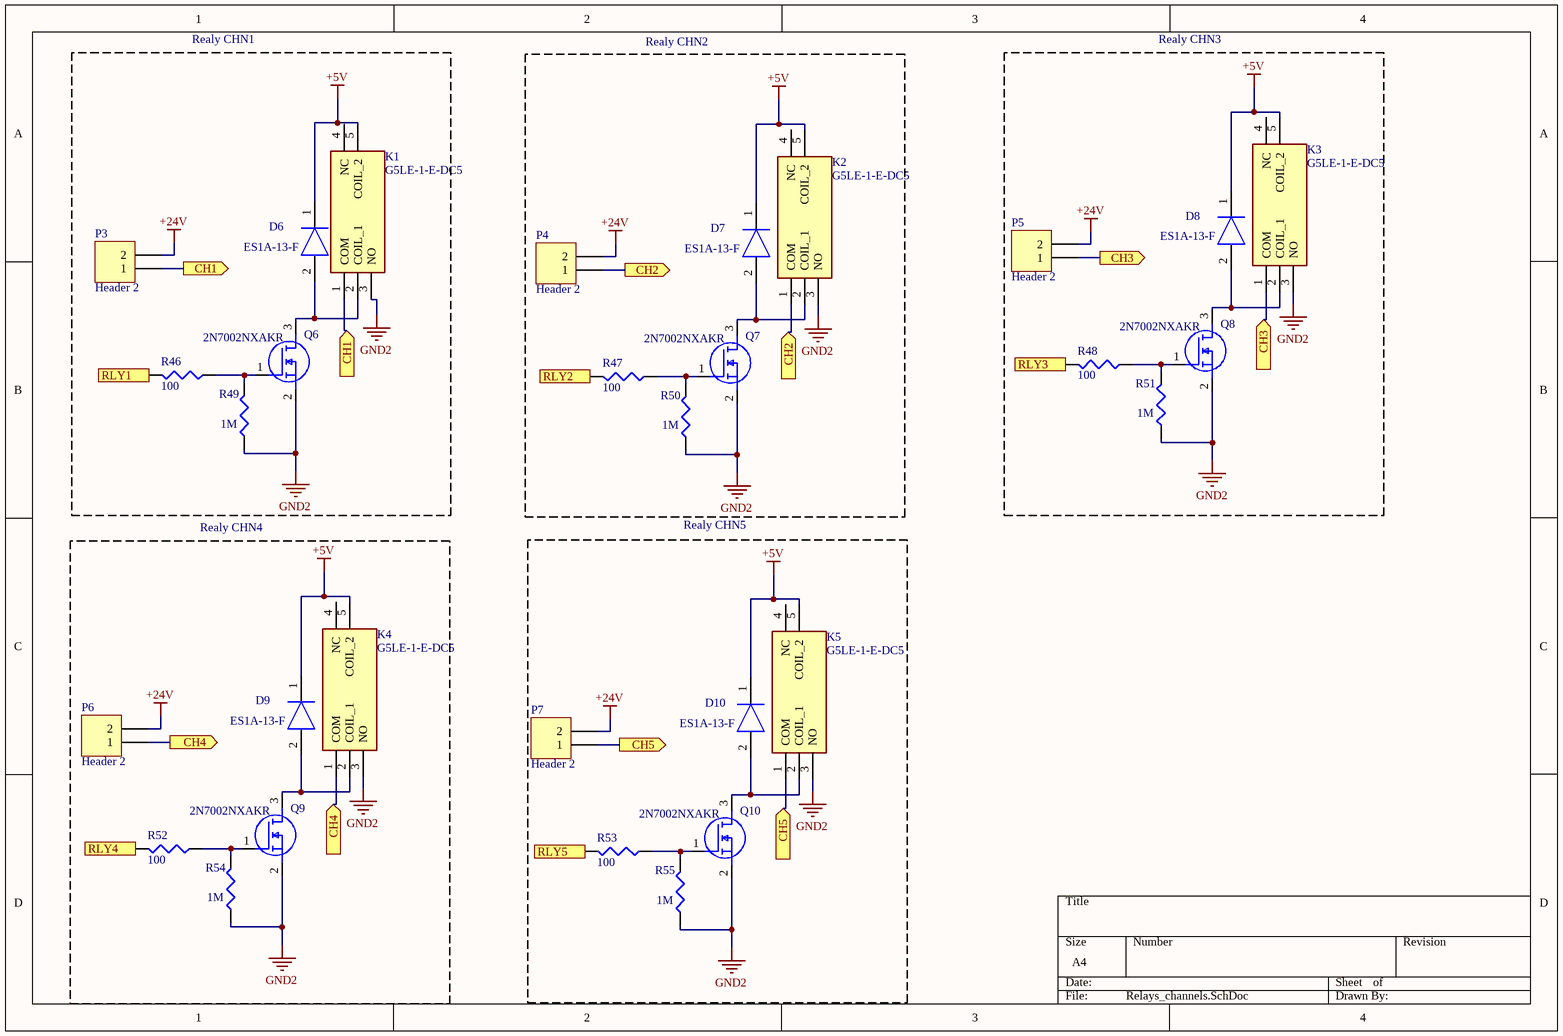
[diagram p8: Relays_channels.SchDoc]

### Parts
D6  ES1A-13-F  [DIOM5226X240N]
D7  ES1A-13-F  [DIOM5226X240N]
D8  ES1A-13-F  [DIOM5226X240N]
D9  ES1A-13-F  [DIOM5226X240N]
D10  ES1A-13-F  [DIOM5226X240N]
K1  G5LE-1-E-DC5  [G5LE-1]
K2  G5LE-1-E-DC5  [G5LE-1]
K3  G5LE-1-E-DC5  [G5LE-1]
K4  G5LE-1-E-DC5  [G5LE-1]
K5  G5LE-1-E-DC5  [G5LE-1]
P3  Header 2  [HDR1X2]
P4  Header 2  [HDR1X2]
P5  Header 2  [HDR1X2]
P6  Header 2  [HDR1X2]
P7  Header 2  [HDR1X2]
Q6  2N7002NXAKR  [SOT95P230X110-3N]
Q7  2N7002NXAKR  [SOT95P230X110-3N]
Q8  2N7002NXAKR  [SOT95P230X110-3N]
Q9  2N7002NXAKR  [SOT95P230X110-3N]
Q10  2N7002NXAKR  [SOT95P230X110-3N]
R46  value 100  [J1-0603]  (hidden comment: Res3)
R47  value 100  [J1-0603]  (hidden comment: Res3)
R48  value 100  [J1-0603]  (hidden comment: Res3)
R49  value 1M  [J1-0603]  (hidden comment: Res3)
R50  value 1M  [J1-0603]  (hidden comment: Res3)
R51  value 1M  [J1-0603]  (hidden comment: Res3)
R52  value 100  [J1-0603]  (hidden comment: Res3)
R53  value 100  [J1-0603]  (hidden comment: Res3)
R54  value 1M  [J1-0603]  (hidden comment: Res3)
R55  value 1M  [J1-0603]  (hidden comment: Res3)

### Blocks framed on the sheet
Realy CHN1: D6 K1 P3 Q6 R46 R49
Realy CHN2: D7 K2 P4 Q7 R47 R50
Realy CHN3: D8 K3 P5 Q8 R48 R51
Realy CHN4: D9 K4 P6 Q9 R52 R54
Realy CHN5: D10 K5 P7 Q10 R53 R55

### Ports
CH1 (in), CH1 (out), CH2 (in), CH2 (out), CH3 (in), CH3 (out), CH4 (in), CH4 (out), CH5 (in), CH5 (out), RLY1 (in), RLY2 (in), RLY3 (in), RLY4 (in), RLY5 (in)

### Nets
+5V: D6.1(K) D7.1(K) D8.1(K) D9.1(K) D10.1(K) K1.5(COIL_2) K2.5(COIL_2) K3.5(COIL_2) K4.5(COIL_2) K5.5(COIL_2)
+24V: P3.2 P4.2 P5.2 P6.2 P7.2
GND2: K1.3(NO) K2.3(NO) K3.3(NO) K4.3(NO) K5.3(NO) Q6.2(S) Q7.2(S) Q8.2(S) Q9.2(S) Q10.2(S) R49.1 R50.1 R51.1 R54.1 R55.1
Net3W-RTD_1: K2.1(COM) K3.1(COM) P4.1 P5.1 ; port CH2, port CH3
Net3W-RTD_3: K4.1(COM) P6.1 ; port CH4
NetD6_2: D6.2(A) K1.2(COIL_1) Q6.3(D)
NetD7_2: D7.2(A) K2.2(COIL_1) Q7.3(D)
NetD8_2: D8.2(A) K3.2(COIL_1) Q8.3(D)
NetD9_2: D9.2(A) K4.2(COIL_1) Q9.3(D)
NetD10_2: D10.2(A) K5.2(COIL_1) Q10.3(D)
NetIC8_16: K1.1(COM) P3.1 ; port CH1
NetIC8_20: K5.1(COM) P7.1 ; port CH5
NetMCU_87: R46.2 ; port RLY1
NetMCU_88: R47.2 ; port RLY2
NetMCU_89: R48.2 ; port RLY3
NetMCU_90: R52.2 ; port RLY4
NetMCU_91: R53.2 ; port RLY5
NetQ6_1: Q6.1(G) R46.1 R49.2
NetQ7_1: Q7.1(G) R47.1 R50.2
NetQ8_1: Q8.1(G) R48.1 R51.2
NetQ9_1: Q9.1(G) R52.1 R54.2
NetQ10_1: Q10.1(G) R53.1 R55.2

Not connected (* = marked no-connect by the designer): K1 4(NC); K2 4(NC); K3 4(NC); K4 4(NC); K5 4(NC)

### Library data of the parts
D6-D10 = ES1A-13-F: Diode; Manufacturer_Name: Diodes Inc.; Datasheet Link: http://www.diodes.com/_files/datasheets/ds14001.pdf; Height: 2.4mm; Manufacturer_Part_Number: ES1A-13-F; Mouser Part Number: 621-ES1A-F; Mouser Price/Stock: https://www.mouser.co.uk/ProductDetail/Diodes-Incorporated/ES1A-13-F/?qs=CcKFP491uOOqYN0bONi7Aw%3D%3D; Arrow Part Number: ES1A-13-F; Arrow Price/Stock: https://www.arrow.com/en/products/es1a-13-f/diodes-incorporated
K1-K5 = G5LE-1-E-DC5: Relay or Contactor; Manufacturer_Name: Omron Electronics; Datasheet Link: https://componentsearchengine.com/Datasheets/1/G5LE-1-E-DC5.pdf; Manufacturer_Part_Number: G5LE-1-E-DC5; Mouser Part Number: 653-G5LE-1-E-DC5; Mouser Price/Stock: https://www.mouser.co.uk/ProductDetail/Omron-Electronics/G5LE-1-E-DC5/?qs=aEuGZpxfbxVbuaOF%252B%252BGlRA%3D%3D
P3-P7 = Header 2: Header, 2-Pin; LatestRevisionDate: 17-Jul-2002; LatestRevisionNote: Re-released for DXP Platform.; Publisher: Altium Limited
Q6-Q10 = 2N7002NXAKR: as Q2 on sheet Led RGB; Datasheet Link: https://mouser.componentsearchengine.com/Datasheets/2/2N7002NXAKR.pdf; Height: 1.1mm; Manufacturer_Part_Number: 2N7002NXAKR; Mouser Part Number: 771-2N7002NXAKR; Mouser Price/Stock: https://www.mouser.co.uk/ProductDetail/Nexperia/2N7002NXAKR/?qs=%252B6g0mu59x7JoAsZYPFXqhw%3D%3D; Arrow Part Number: 2N7002NXAKR; Arrow Price/Stock: https://www.arrow.com/en/products/2n7002nxakr/nexperia
R46-R55 = Res3: Resistor; Published: 8-Jun-2000; LatestRevisionDate: 29-May-2009; LatestRevisionNote: IPC-7351 Footprint Added.; PackageReference: J1-0603; Publisher: Altium Limited; PackageDescription: Chip Resistor

## Sheet TMPT_LTC_1.SchDoc
size A4; SheetNumber: 10; SheetTotal: 10
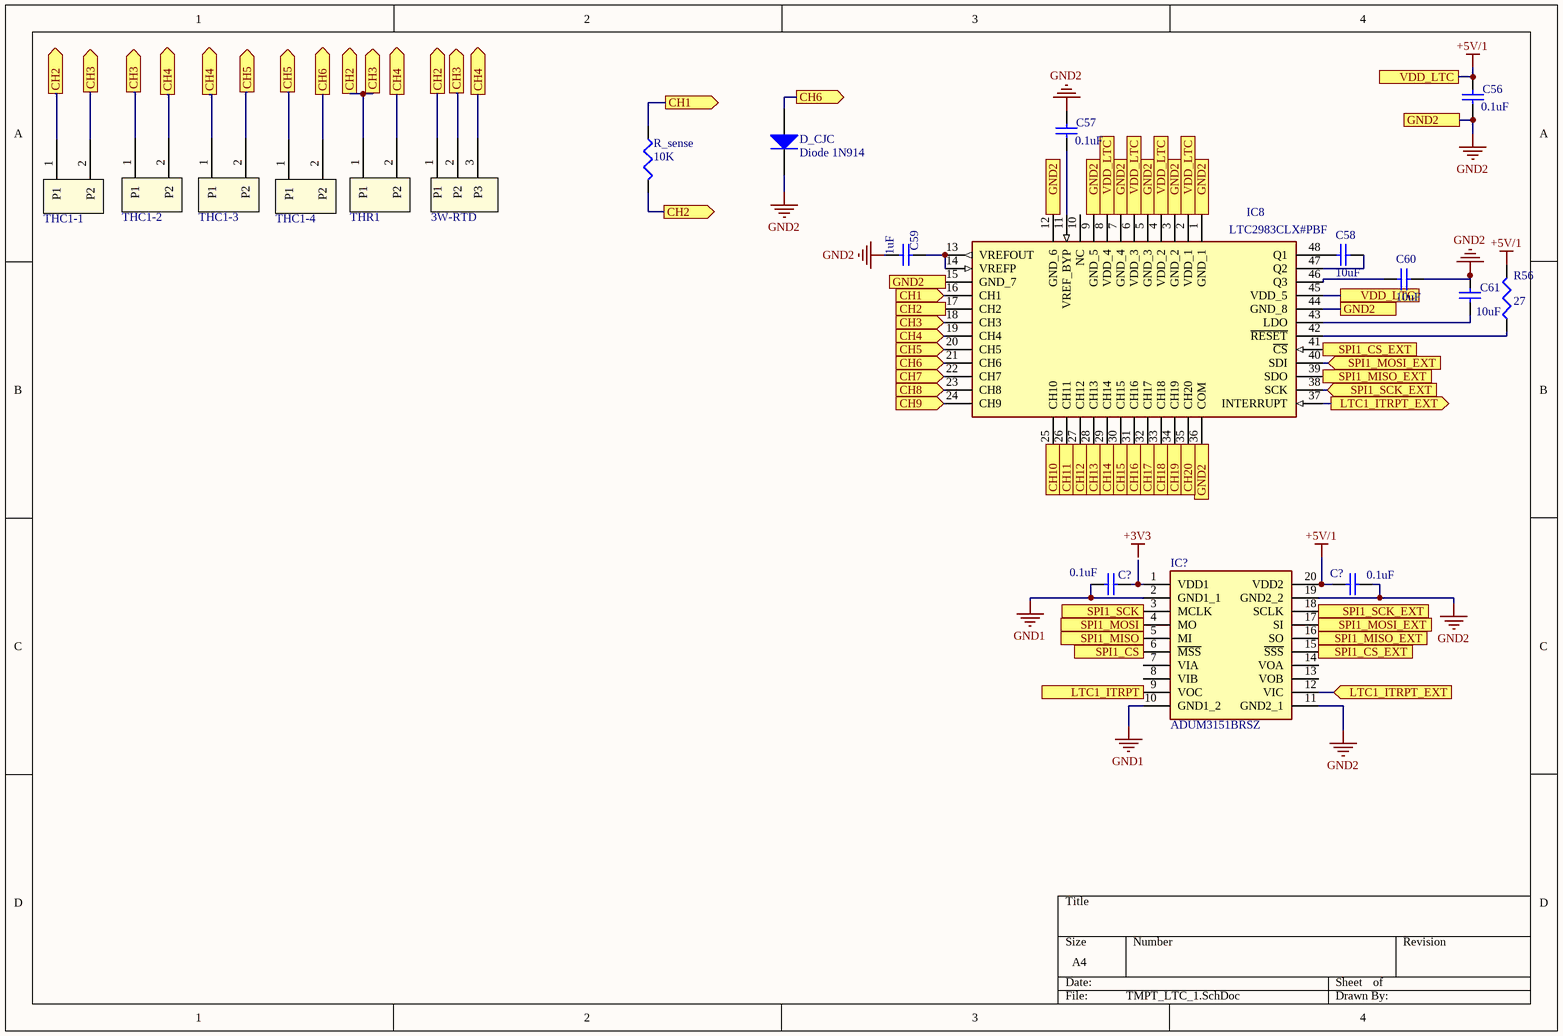
[diagram p9: TMPT_LTC_1.SchDoc]

### Parts
(Parts that share a designator on the sheet are numbered #1, #2 ... from top to bottom, then left to right.)
3W-RTD  PCC-SMD-1000-3  [PCC-SMD-1000-3]  (value not drawn)
C56  value 0.1uF  [1608[0603]]  (hidden comment: Cap Semi)
C57  value 0.1uF  [1608[0603]]  (hidden comment: Cap Semi)
C58  value 10uF  [C1206]  (hidden comment: X7R)
C59  value 1uF  [1608[0603]]  (hidden comment: Cap Semi)
C60  value 10uF  [1608[0603]]  (hidden comment: X5R)
C61  value 10uF  [1608[0603]]  (hidden comment: Cap Semi)
C?#1  value 0.1uF  [C1206]  (hidden comment: X7R)
C?#2  value 0.1uF  [C1206]  (hidden comment: X7R)
D_CJC  Diode 1N914  [DO-35]
IC8  LTC2983CLX#PBF  [QFP50P900X900X160-48N]
IC?  ADUM3151BRSZ  [SOP65P780X200-20N]
R56  value 27  [J1-0603]  (hidden comment: Res3)
R_sense  value 10K  [J1-0603]  (hidden comment: Res3)
THC1-1  PCC-SMD-1000-2  [PCC-SMD-1000]  (value not drawn)
THC1-2  PCC-SMD-1000-2  [PCC-SMD-1000]  (value not drawn)
THC1-3  PCC-SMD-1000-2  [PCC-SMD-1000]  (value not drawn)
THC1-4  PCC-SMD-1000-2  [PCC-SMD-1000]  (value not drawn)
THR1  PCC-SMD-1000-2  [PCC-SMD-1000]  (value not drawn)

### Ports
CH1 (in), CH1 (out), CH2 (in), CH2 (out), CH3 (in), CH3 (out), CH4 (in), CH4 (out), CH5 (in), CH5 (out), CH6 (in), CH6 (out), CH7 (in), CH8 (in), CH9 (in), CH10 (in), CH11 (in), CH12 (in), CH13 (in), CH14 (in), CH15 (in), CH16 (in), CH17 (in), CH18 (in), CH19 (in), CH20 (in), GND2, LTC1_ITRPT (out), LTC1_ITRPT_EXT (in), LTC1_ITRPT_EXT (out), SPI1_CS (in), SPI1_CS_EXT (in), SPI1_CS_EXT (out), SPI1_MISO (out), SPI1_MISO_EXT (in), SPI1_MISO_EXT (out), SPI1_MOSI (in), SPI1_MOSI_EXT (in), SPI1_MOSI_EXT (out), SPI1_SCK (in), SPI1_SCK_EXT (in), SPI1_SCK_EXT (out), VDD_LTC

### Nets
+5V/1: C56.2 C?#2.2 IC8.2(VDD_1) IC8.4(VDD_2) IC8.6(VDD_3) IC8.8(VDD_4) IC8.45(VDD_5) IC?.20(VDD2) R56.2 ; port VDD_LTC
GND1: C?#1.2 IC?.2(GND1_1) IC?.10(GND1_2)
GND2: C56.1 C57.2 C59.2 C60.1 C61.2 C?#2.1 D_CJC.2(K) IC8.1(GND_1) IC8.3(GND_2) IC8.5(GND_3) IC8.7(GND_4) IC8.9(GND_5) IC8.12(GND_6) IC8.15(GND_7) IC8.36(COM) IC8.44(GND_8) IC?.11(GND2_1) IC?.19(GND2_2) ; port GND2
Net3W-RTD_1: 3W-RTD.1(P1) 3W-RTD.2(P2) IC8.17(CH2) IC8.18(CH3) R_sense.2 THC1-1.1(P1) THC1-1.2(P2) THC1-2.1(P1) THR1.1(P1) ; port CH2, port CH3
Net3W-RTD_3: 3W-RTD.3(P3) IC8.19(CH4) THC1-2.2(P2) THC1-3.1(P1) THR1.2(P2) ; port CH4
NetC57_1: C57.1 IC8.11(VREF_BYP)
NetC58_1: C58.1 IC8.47(Q2)
NetC58_2: C58.2 IC8.48(Q1)
NetC59_1: C59.1 IC8.13(VREFOUT) IC8.14(VREFP)
NetC60_2: C60.2 IC8.46(Q3)
NetC61_1: C61.1 IC8.43(LDO)
NetC?#1_1: C?#1.1 IC?.1(VDD1)
NetD_CJC_1: D_CJC.1(A) IC8.21(CH6) THC1-4.2(P2) ; port CH6
NetIC8_16: IC8.16(CH1) R_sense.1 ; port CH1
NetIC8_20: IC8.20(CH5) THC1-3.2(P2) THC1-4.1(P1) ; port CH5
NetIC8_22: IC8.22(CH7) ; port CH7
NetIC8_23: IC8.23(CH8) ; port CH8
NetIC8_24: IC8.24(CH9) ; port CH9
NetIC8_25: IC8.25(CH10) ; port CH10
NetIC8_26: IC8.26(CH11) ; port CH11
NetIC8_27: IC8.27(CH12) ; port CH12
NetIC8_28: IC8.28(CH13) ; port CH13
NetIC8_29: IC8.29(CH14) ; port CH14
NetIC8_30: IC8.30(CH15) ; port CH15
NetIC8_31: IC8.31(CH16) ; port CH16
NetIC8_32: IC8.32(CH17) ; port CH17
NetIC8_33: IC8.33(CH18) ; port CH18
NetIC8_34: IC8.34(CH19) ; port CH19
NetIC8_35: IC8.35(CH20) ; port CH20
NetIC8_37: IC8.37(INTERRUPT) IC?.12(VIC) ; port LTC1_ITRPT_EXT
NetIC8_38: IC8.38(SCK) IC?.18(SCLK) ; port SPI1_SCK_EXT
NetIC8_39: IC8.39(SDO) IC?.16(SO) ; port SPI1_MISO_EXT
NetIC8_40: IC8.40(SDI) IC?.17(SI) ; port SPI1_MOSI_EXT
NetIC8_41: IC8.41(~{CS}) IC?.15(~{SSS}) ; port SPI1_CS_EXT
NetIC8_42: IC8.42(~{RESET}) R56.1
NetIC?_3: IC?.3(MCLK) ; port SPI1_SCK
NetIC?_4: IC?.4(MO) ; port SPI1_MOSI
NetIC?_5: IC?.5(MI) ; port SPI1_MISO
NetIC?_6: IC?.6(~{MSS}) ; port SPI1_CS
NetIC?_9: IC?.9(VOC) ; port LTC1_ITRPT

Not connected (* = marked no-connect by the designer): IC8 10(NC); IC? 7(VIA) 8(VIB) 13(VOB) 14(VOA)

### Notes on the sheet
- Labels drawn without touching a wire or pin: +3V3

### Library data of the parts
3W-RTD = PCC-SMD-1000-3: Circuit Board Thermocouple, RTD, Thermistor Connectors For Miniature Connectors
C56-C61 C?#1 C?#2 = Cap Semi: Capacitor (Semiconductor SIM Model); Published: 8-Jun-2000; LatestRevisionDate: 29-May-2009; LatestRevisionNote: IPC-7351 Footprint Added.; PackageReference: C1206; Publisher: Altium Limited; PackageDescription: Chip Capacitor
D_CJC = Diode 1N914: High Conductance Fast Diode, Cold Juntion Compensation Diode; Published: 8-Jun-2000; LatestRevisionDate: 17-Jul-2002; LatestRevisionNote: Re-released for DXP Platform.; DatasheetVersion: 1997; PackageReference: DO-35; Publisher: Altium Limited; PackageDescription: Diode, Axial; Body 3.8 x 1.9 mm (LxDia. max), Lead Dia. 0.53 mm (max); Code_JEDEC: DO-204-AH; ComponentLink1Description: Manufacturer Link; ComponentLink1URL: http://www.fairchildsemi.com/; ComponentLink2Description: Datasheet; ComponentLink2URL: http://www.fairchildsemi.com/ds/1N%2F1N4448.pdf
IC8 = LTC2983CLX#PBF: Integrated Circuit; Manufacturer_Name: Linear Technology; Datasheet Link: http://cds.linear.com/docs/en/datasheet/2983fc.pdf; Height: 1.6mm; Manufacturer_Part_Number: LTC2983CLX#PBF; Mouser Part Number: 584-LTC2983CLX#PBF; Mouser Price/Stock: https://www.mouser.co.uk/ProductDetail/Analog-Devices-Linear-Technology/LTC2983CLXPBF?qs=hVkxg5c3xu8Vsoy0K2bp%252Bw%3D%3D; Arrow Part Number: LTC2983CLX#PBF; Arrow Price/Stock: https://www.arrow.com/en/products/ltc2983clxpbf/linear-technology
IC? = ADUM3151BRSZ: Integrated Circuit; Manufacturer_Name: Analog Devices; Datasheet Link: https://www.mouser.com/ds/2/609/ADuM3151_3152_3153-879058.pdf; Height: 2mm; Manufacturer_Part_Number: ADUM3151BRSZ; Mouser Part Number: 584-ADUM3151BRSZ; Mouser Price/Stock: https://www.mouser.co.uk/ProductDetail/Analog-Devices/ADUM3151BRSZ/?qs=hpwIUhX6lWzP%2FeQf8%252BDxeA%3D%3D; Arrow Part Number: ADUM3151BRSZ; Arrow Price/Stock: https://www.arrow.com/en/products/adum3151brsz/analog-devices
R56 R_sense = Res3: Resistor; Published: 8-Jun-2000; LatestRevisionDate: 29-May-2009; LatestRevisionNote: IPC-7351 Footprint Added.; PackageReference: J1-0603; Publisher: Altium Limited; PackageDescription: Chip Resistor
THC1-1-THC1-4 THR1 = PCC-SMD-1000-2: Circuit Board Thermocouple, RTD, Thermistor Connectors For Miniature Connectors